# Altium project rev02.PrjPcb (part 2 of 2)

## Sheet rev02_18.SchDoc
size 282 x 200 mm
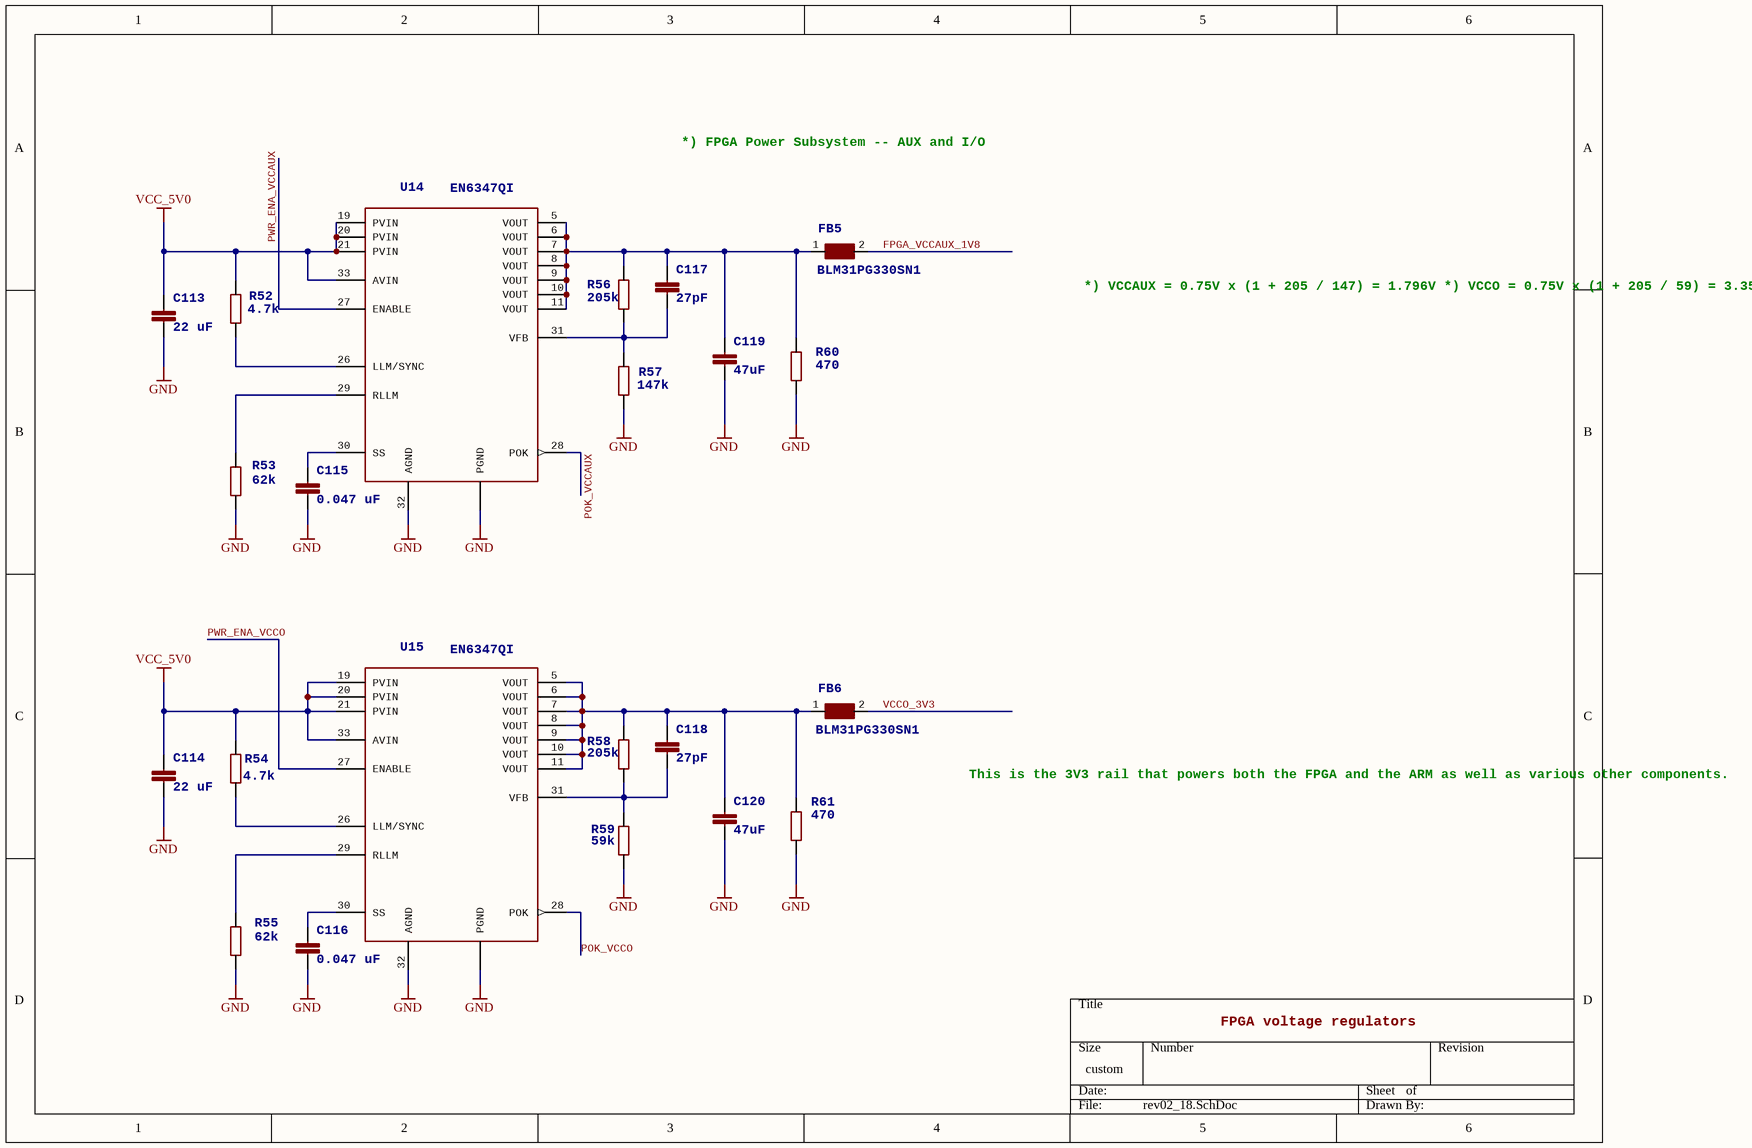
[diagram p20: rev02_18.SchDoc]

### Parts
C113  value 22 uF  >NAME: C113  [C_1210]  (hidden comment: C3225X5R1C226M250AA)
C114  value 22 uF  >NAME: C114  [C_1210]  (hidden comment: C3225X5R1C226M250AA)
C115  value 0.047 uF  >NAME: C115  [C_0402]
C116  value 0.047 uF  >NAME: C116  [C_0402]
C117  value 27pF  >NAME: C117  [C_0402]
C118  value 27pF  >NAME: C118  [C_0402]
C119  value 47uF  >NAME: C119  [C_1210]  (hidden comment: GRM32ER70J476ME20L)
C120  value 47uF  >NAME: C120  [C_1210]  (hidden comment: GRM32ER70J476ME20L)
FB5  BLM31PG330SN1  [L_1206]
FB6  BLM31PG330SN1  [L_1206]
R52  value 4.7k  >NAME: R52  [R_0402]
R53  value 62k  >NAME: R53  [R_0402]
R54  value 4.7k  >NAME: R54  [R_0402]
R55  value 62k  >NAME: R55  [R_0402]
R56  value 205k  >NAME: R56  [R_0402]
R57  value 147k  >NAME: R57  [R_0402]
R58  value 205k  >NAME: R58  [R_0402]
R59  value 59k  >NAME: R59  [R_0402]
R60  value 470  >NAME: R60  [R_0402]
R61  value 470  >NAME: R61  [R_0402]
U14  EN6347QI  [QFN38]
U15  EN6347QI  [QFN38]

### Nets
FPGA_VCCAUX_1V8: FB5.2
GND: C113.2 C114.2 C115.2 C116.2 C119.2 C120.2 R53.1 R55.1 R57.1 R59.1 R60.1 R61.1 U14.13(PGND) U14.14(PGND) U14.15(PGND) U14.16(PGND) U14.17(PGND) U14.18(PGND) U14.32(AGND) U14.PAD39(PGND) U15.13(PGND) U15.14(PGND) U15.15(PGND) U15.16(PGND) U15.17(PGND) U15.18(PGND) U15.32(AGND) U15.PAD39(PGND)
VCC_5V0: C113.1 C114.1 R52.2 R54.2 U14.19(PVIN) U14.20(PVIN) U14.21(PVIN) U14.33(AVIN) U15.19(PVIN) U15.20(PVIN) U15.21(PVIN) U15.33(AVIN)
VCCO_3V3: FB6.2
POK_VCCAUX: U14.28(POK)
POK_VCCO: U15.28(POK)
PWR_ENA_VCCAUX: U14.27(ENABLE)
PWR_ENA_VCCO: U15.27(ENABLE)
NetC115_1: C115.1 U14.30(SS)
NetC116_1: C116.1 U15.30(SS)
NetC117_1: C117.1 C119.1 FB5.1 R56.2 R60.2 U14.5(VOUT) U14.6(VOUT) U14.7(VOUT) U14.8(VOUT) U14.9(VOUT) U14.10(VOUT) U14.11(VOUT)
NetC117_2: C117.2 R56.1 R57.2 U14.31(VFB)
NetC118_1: C118.1 C120.1 FB6.1 R58.2 R61.2 U15.5(VOUT) U15.6(VOUT) U15.7(VOUT) U15.8(VOUT) U15.9(VOUT) U15.10(VOUT) U15.11(VOUT)
NetC118_2: C118.2 R58.1 R59.2 U15.31(VFB)
NetR52_1: R52.1 U14.26(LLM/SYNC)
NetR53_2: R53.2 U14.29(RLLM)
NetR54_1: R54.1 U15.26(LLM/SYNC)
NetR55_2: R55.2 U15.29(RLLM)

Not connected (* = marked no-connect by the designer): U14 1(NC) 2(NC) 3(NC) 4(NC) 12(NC) 22(NC) 23(NC) 24(NC) 25(NC) 34(NC) 35(NC) 36(NC) 37(NC) 38(NC); U15 1(NC) 2(NC) 3(NC) 4(NC) 12(NC) 22(NC) 23(NC) 24(NC) 25(NC) 34(NC) 35(NC) 36(NC) 37(NC) 38(NC)

### Notes on the sheet
- *) FPGA Power Subsystem -- AUX and I/O
- *) VCCAUX = 0.75V x (1 + 205 / 147) = 1.796V
  *) VCCO = 0.75V x (1 + 205 / 59) = 3.356
  *) Minimal load current is 2 mA:
  1.8V / 470 Ohm = ~4mA
  3.3V /  470 Ohm = ~7mA
  *) Light-load mode is enabled
- This is the 3V3 rail that powers
  both the FPGA and the ARM as well
  as various other components.
- FPGA voltage regulators

### Library data of the parts
C113 C114 = C-EUC1210: 1210 CAPACITOR; DIELECTRIC: X5R; RATED_VOLTAGE: 16V; TOLERANCE: 20%
C115 C116 = C-EUC0402: as C4 on sheet rev02_1
C117 C118 = C-EUC0402: 0402 CAPACITOR; DIELECTRIC: C0G; RATED_VOLTAGE: 50V; TOLERANCE: 5%
C119 C120 = C-EUC1210: as C8 on sheet rev02_1; DIELECTRIC: X5R
FB5 FB6 = BLM31PG330SN1_1206
R52-R55 R60 R61 = R-EU_R0402: 0402 Resistor 5%; TOLERANCE: 5%
R56-R59 = R-EU_R0402: 0402 Resistor 1%; TOLERANCE: 1%
U14 U15 = EN6347QI: 3A PowerSoC / Voltage Mode Synchronous PWM Buck with Integrated Inductor; >NAME: U14; MPN: EN6347QI; OC_FARNELL: 2081146; PACKAGE: QFN; SUPPLIER: ENPIRION; >VALUE: EN6347QI

## Sheet rev02_19.SchDoc
size 282 x 200 mm
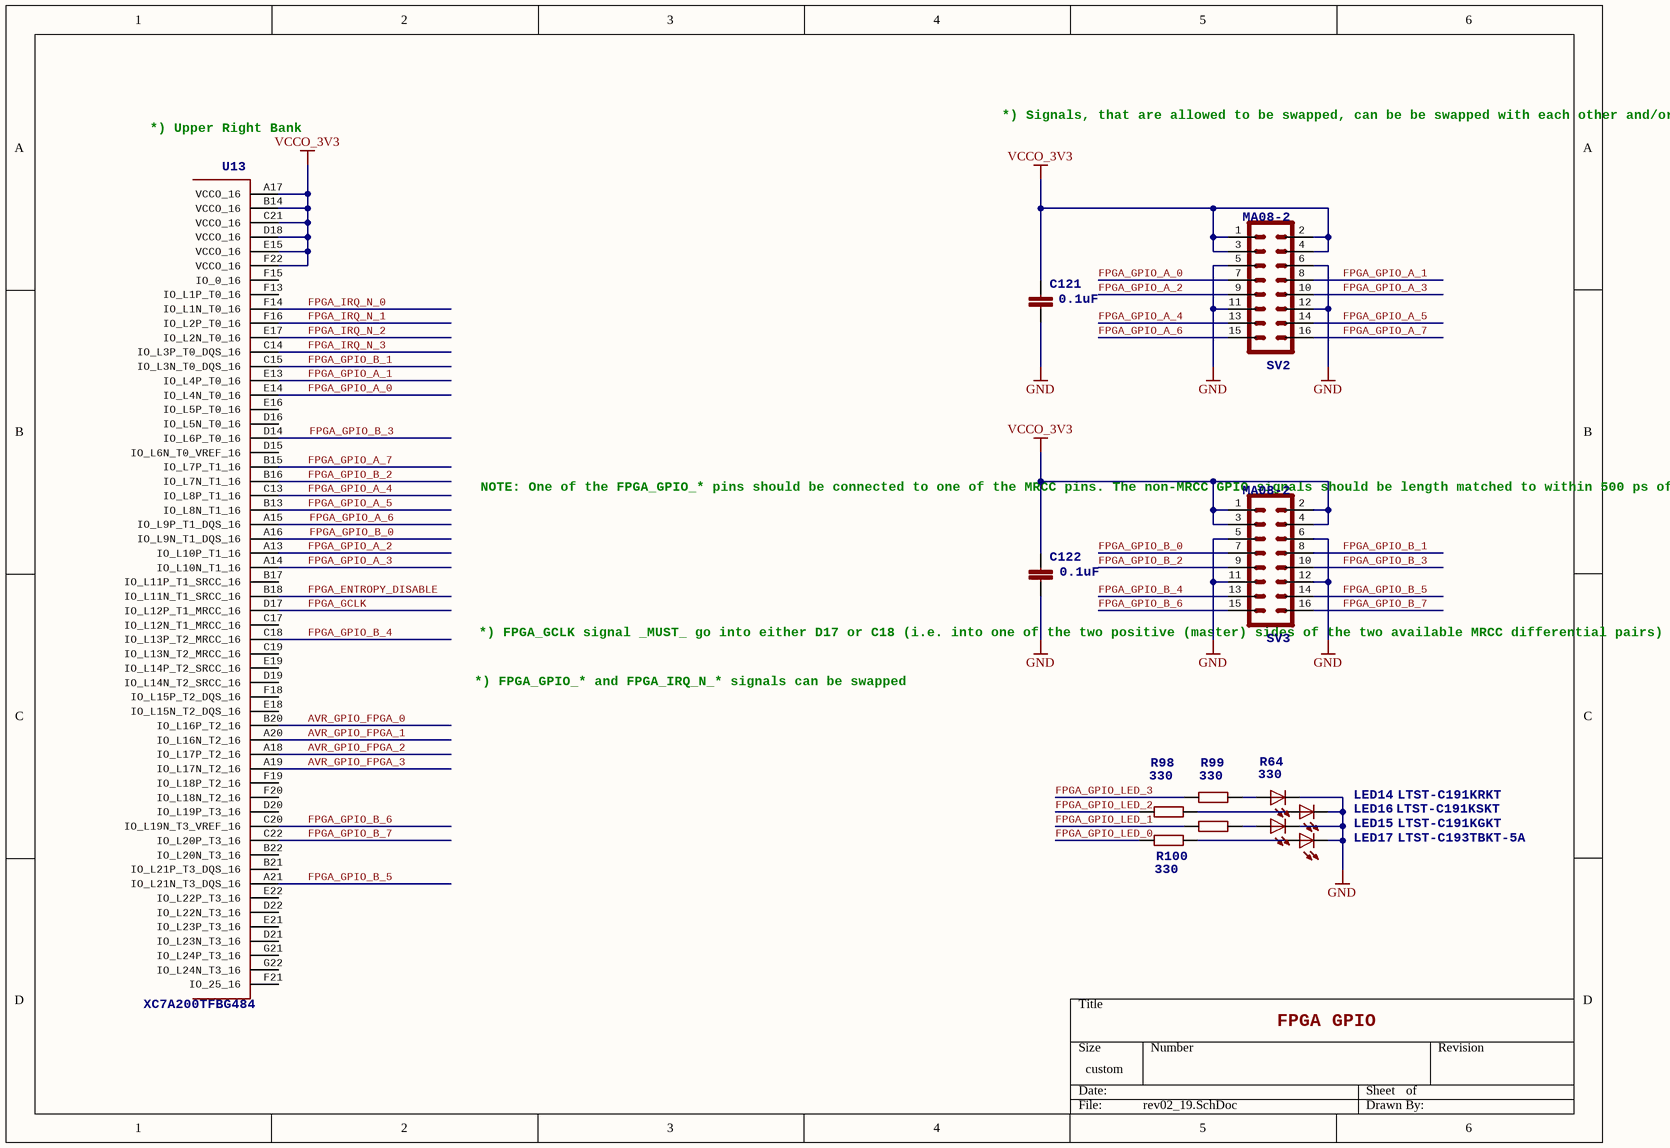
[diagram p21: rev02_19.SchDoc]

### Parts
C121  value 0.1uF  >NAME: C121  [C_0402]
C122  value 0.1uF  >NAME: C122  [C_0402]
LED14  LTST-C191KRKT  [VD_0603]
LED15  LTST-C191KGKT  [VD_0603]
LED16  LTST-C191KSKT  [VD_0603]
LED17  LTST-C193TBKT-5A  [VD_0603]
R64  value 330  [R_0402]
R98  value 330  [R_0402]
R99  value 330  [R_0402]
R100  value 330  [R_0402]
SV2  >NAME: SV2  [PLD-16]  (hidden comment: MA08-2)
SV3  >NAME: SV3  [PLD-16]  (hidden comment: MA08-2)
U13  >NAME: U13  [BGA484C100P22X22_2300X2300X254]  (hidden comment: XC7A200TFBG484)  (part E of 17)

### Nets
GND: C121.2 C122.2 LED14.2(C) LED15.2(C) LED16.2(C) LED17.2(C) SV2.5 SV2.6 SV2.11 SV2.12 SV3.5 SV3.6 SV3.11 SV3.12
VCCO_3V3: C121.1 C122.1 SV2.1 SV2.2 SV2.3 SV2.4 SV3.1 SV3.2 SV3.3 SV3.4 U13.A17(VCCO_16) U13.B14(VCCO_16) U13.C21(VCCO_16) U13.D18(VCCO_16) U13.E15(VCCO_16) U13.F22(VCCO_16)
AVR_GPIO_FPGA_0: U13.B20(IO_L16P_T2_16)
AVR_GPIO_FPGA_1: U13.A20(IO_L16N_T2_16)
AVR_GPIO_FPGA_2: U13.A18(IO_L17P_T2_16)
AVR_GPIO_FPGA_3: U13.A19(IO_L17N_T2_16)
FPGA_ENTROPY_DISABLE: U13.B18(IO_L11N_T1_SRCC_16)
FPGA_GCLK: U13.D17(IO_L12P_T1_MRCC_16)
FPGA_GPIO_A_0: SV2.7 U13.E14(IO_L4N_T0_16)
FPGA_GPIO_A_1: SV2.8 U13.E13(IO_L4P_T0_16)
FPGA_GPIO_A_2: SV2.9 U13.A13(IO_L10P_T1_16)
FPGA_GPIO_A_3: SV2.10 U13.A14(IO_L10N_T1_16)
FPGA_GPIO_A_4: SV2.13 U13.C13(IO_L8P_T1_16)
FPGA_GPIO_A_5: SV2.14 U13.B13(IO_L8N_T1_16)
FPGA_GPIO_A_6: SV2.15 U13.A15(IO_L9P_T1_DQS_16)
FPGA_GPIO_A_7: SV2.16 U13.B15(IO_L7P_T1_16)
FPGA_GPIO_B_0: SV3.7 U13.A16(IO_L9N_T1_DQS_16)
FPGA_GPIO_B_1: SV3.8 U13.C15(IO_L3N_T0_DQS_16)
FPGA_GPIO_B_2: SV3.9 U13.B16(IO_L7N_T1_16)
FPGA_GPIO_B_3: SV3.10 U13.D14(IO_L6P_T0_16)
FPGA_GPIO_B_4: SV3.13 U13.C18(IO_L13P_T2_MRCC_16)
FPGA_GPIO_B_5: SV3.14 U13.A21(IO_L21N_T3_DQS_16)
FPGA_GPIO_B_6: SV3.15 U13.C20(IO_L19N_T3_VREF_16)
FPGA_GPIO_B_7: SV3.16 U13.C22(IO_L20P_T3_16)
FPGA_GPIO_LED_0: R100.2
FPGA_GPIO_LED_1: R64.2
FPGA_GPIO_LED_2: R98.2
FPGA_GPIO_LED_3: R99.2
FPGA_IRQ_N_0: U13.F14(IO_L1N_T0_16)
FPGA_IRQ_N_1: U13.F16(IO_L2P_T0_16)
FPGA_IRQ_N_2: U13.E17(IO_L2N_T0_16)
FPGA_IRQ_N_3: U13.C14(IO_L3P_T0_DQS_16)
NetLED14_1: LED14.1(A) R99.1
NetLED15_1: LED15.1(A) R64.1
NetLED16_1: LED16.1(A) R98.1
NetLED17_1: LED17.1(A) R100.1

Not connected (* = marked no-connect by the designer): U13 B17(IO_L11P_T1_SRCC_16) B21(IO_L21P_T3_DQS_16) B22(IO_L20N_T3_16) C17(IO_L12N_T1_MRCC_16) C19(IO_L13N_T2_MRCC_16) D15(IO_L6N_T0_VREF_16) D16(IO_L5N_T0_16) D19(IO_L14N_T2_SRCC_16) D20(IO_L19P_T3_16) D21(IO_L23N_T3_16) D22(IO_L22N_T3_16) E16(IO_L5P_T0_16) E18(IO_L15N_T2_DQS_16) E19(IO_L14P_T2_SRCC_16) E21(IO_L23P_T3_16) E22(IO_L22P_T3_16) F13(IO_L1P_T0_16) F15(IO_0_16) F18(IO_L15P_T2_DQS_16) F19(IO_L18P_T2_16) F20(IO_L18N_T2_16) F21(IO_25_16) G21(IO_L24P_T3_16) G22(IO_L24N_T3_16)

### Notes on the sheet
- *) Upper Right Bank
- *) Signals, that are allowed to be swapped, can be be swapped
  with each other and/or moved to different pins within their bank.
- (near SV3) NOTE: One of the FPGA_GPIO_* pins
  should be connected to one of the
  MRCC pins.
  The non-MRCC GPIO signals should be
  length matched to within 500 ps of
  the MRCC signal.
- (near SV3) *) FPGA_GCLK signal _MUST_ go into either D17 or C18
  (i.e. into one of the two positive (master) sides
  of the two available MRCC differential pairs)
- *) FPGA_GPIO_* and FPGA_IRQ_N_* signals can be swapped
- FPGA GPIO

### Library data of the parts
C121 C122 = C-EUC0402: 0402 CAPACITOR; DIELECTRIC: X7R; RATED_VOLTAGE: 50V; TOLERANCE: 10%; >VALUE: 0.1 uF
LED14 = LEDCHIP-LED0603: RED LED
LED15 = LEDCHIP-LED0603: GREEN LED
LED16 = LEDCHIP-LED0603: YELLOW LED
LED17 = LEDCHIP-LED0603: BLUE LED
R64 R98-R100 = R-EU_R0402: 0402 Resistor 5%
SV2 SV3 = MA08-2: PIN HEADER 0.1"; OC_FARNELL: unknown; OC_NEWARK: unknown; >VALUE: MA08-2
U13 = XC7A200TFBG484: Xilinx FPGA: XC7A200TFBG484; MPN: XC7A200T-1FBG484C; MFR: Xilinx; OC_DIGIKEY: 122-1871-ND; >VALUE: XC7A200TFBG484

## Sheet rev02_20.SchDoc
size 282 x 200 mm
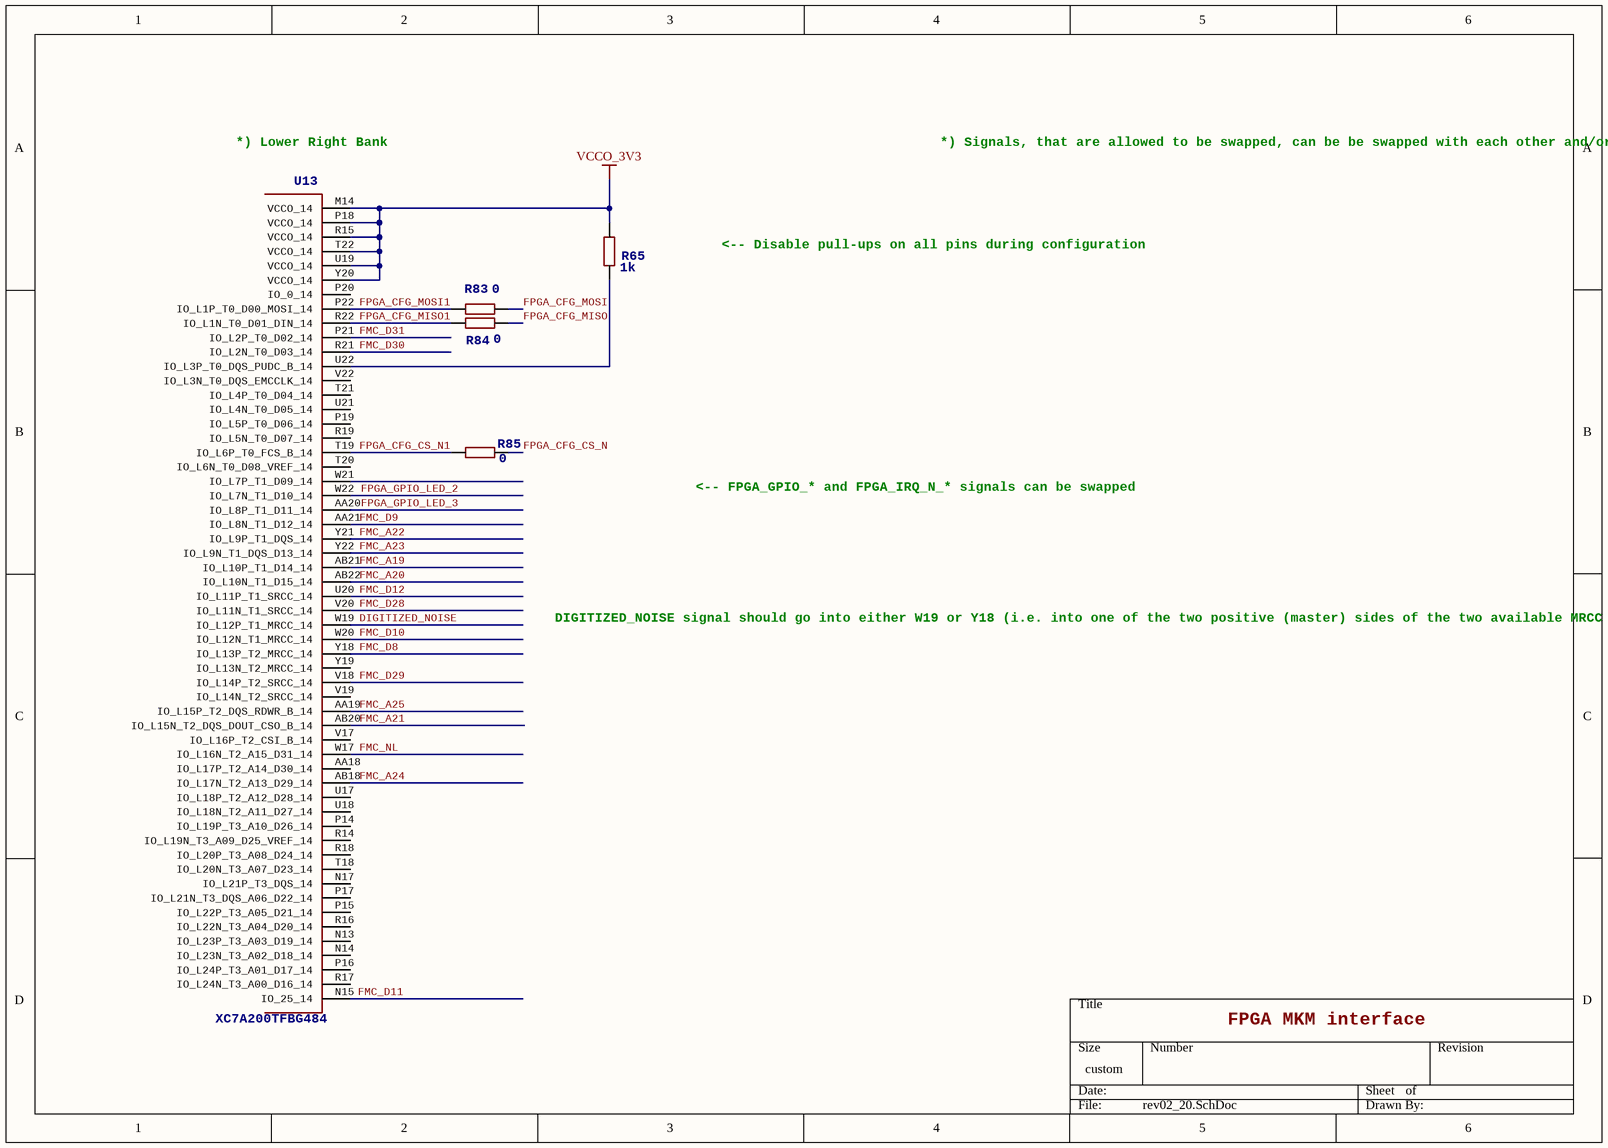
[diagram p22: rev02_20.SchDoc]

### Parts
R65  value 1k  >NAME: R65  [R_0402]
R83  value 0  [R_0402]
R84  value 0  [R_0402]
R85  value 0  [R_0402]
U13  >NAME: U13  [BGA484C100P22X22_2300X2300X254]  (hidden comment: XC7A200TFBG484)  (part C of 17)

### Nets
VCCO_3V3: R65.2 U13.M14(VCCO_14) U13.P18(VCCO_14) U13.R15(VCCO_14) U13.T22(VCCO_14) U13.U19(VCCO_14) U13.Y20(VCCO_14)
DIGITIZED_NOISE: U13.W19(IO_L12P_T1_MRCC_14)
FMC_A19: U13.AB21(IO_L10P_T1_D14_14)
FMC_A20: U13.AB22(IO_L10N_T1_D15_14)
FMC_A21: U13.AB20(IO_L15N_T2_DQS_DOUT_CSO_B_14)
FMC_A22: U13.Y21(IO_L9P_T1_DQS_14)
FMC_A23: U13.Y22(IO_L9N_T1_DQS_D13_14)
FMC_A24: U13.AB18(IO_L17N_T2_A13_D29_14)
FMC_A25: U13.AA19(IO_L15P_T2_DQS_RDWR_B_14)
FMC_D8: U13.Y18(IO_L13P_T2_MRCC_14)
FMC_D9: U13.AA21(IO_L8N_T1_D12_14)
FMC_D10: U13.W20(IO_L12N_T1_MRCC_14)
FMC_D11: U13.N15(IO_25_14)
FMC_D12: U13.U20(IO_L11P_T1_SRCC_14)
FMC_D28: U13.V20(IO_L11N_T1_SRCC_14)
FMC_D29: U13.V18(IO_L14P_T2_SRCC_14)
FMC_D30: U13.R21(IO_L2N_T0_D03_14)
FMC_D31: U13.P21(IO_L2P_T0_D02_14)
FMC_NL: U13.W17(IO_L16N_T2_A15_D31_14)
FPGA_CFG_CS_N: R85.1
FPGA_CFG_CS_N1: R85.2 U13.T19(IO_L6P_T0_FCS_B_14)
FPGA_CFG_MISO: R84.1
FPGA_CFG_MISO1: R84.2 U13.R22(IO_L1N_T0_D01_DIN_14)
FPGA_CFG_MOSI: R83.1
FPGA_CFG_MOSI1: R83.2 U13.P22(IO_L1P_T0_D00_MOSI_14)
FPGA_GPIO_LED_2: U13.W22(IO_L7N_T1_D10_14)
FPGA_GPIO_LED_3: U13.AA20(IO_L8P_T1_D11_14)
NetR65_1: R65.1 U13.U22(IO_L3P_T0_DQS_PUDC_B_14)

Not connected (* = marked no-connect by the designer): U13 AA18(IO_L17P_T2_A14_D30_14) N13(IO_L23P_T3_A03_D19_14) N14(IO_L23N_T3_A02_D18_14) N17(IO_L21P_T3_DQS_14) P14(IO_L19P_T3_A10_D26_14) P15(IO_L22P_T3_A05_D21_14) P16(IO_L24P_T3_A01_D17_14) P17(IO_L21N_T3_DQS_A06_D22_14) P19(IO_L5P_T0_D06_14) P20(IO_0_14) R14(IO_L19N_T3_A09_D25_VREF_14) R16(IO_L22N_T3_A04_D20_14) R17(IO_L24N_T3_A00_D16_14) R18(IO_L20P_T3_A08_D24_14) R19(IO_L5N_T0_D07_14) T18(IO_L20N_T3_A07_D23_14) T20(IO_L6N_T0_D08_VREF_14) T21(IO_L4P_T0_D04_14) U17(IO_L18P_T2_A12_D28_14) U18(IO_L18N_T2_A11_D27_14) U21(IO_L4N_T0_D05_14) V17(IO_L16P_T2_CSI_B_14) V19(IO_L14N_T2_SRCC_14) V22(IO_L3N_T0_DQS_EMCCLK_14) W21(IO_L7P_T1_D09_14) Y19(IO_L13N_T2_MRCC_14)

### Notes on the sheet
- *) Lower Right Bank
- *) Signals, that are allowed to be swapped, can be be swapped
  with each other and/or moved to different pins within their bank.
- <-- Disable pull-ups on all pins during configuration
- <-- FPGA_GPIO_* and FPGA_IRQ_N_* signals can be swapped
- DIGITIZED_NOISE signal should go into
  either W19 or Y18 (i.e. into one of the two
  positive (master) sides of the two available
  MRCC differential pairs)
- FPGA MKM interface

### Library data of the parts
R65 = R-EU_R0402: 0402 Resistor 5%; TOLERANCE: 5%
R83-R85 = R-EU_R0603: 0402 Resistor 5%
U13 = XC7A200TFBG484: as U13 on sheet rev02_19; MFR: Xilinx; OC_DIGIKEY: 122-1871-ND; >VALUE: XC7A200TFBG484

## Sheet rev02_21.SchDoc
size 282 x 200 mm
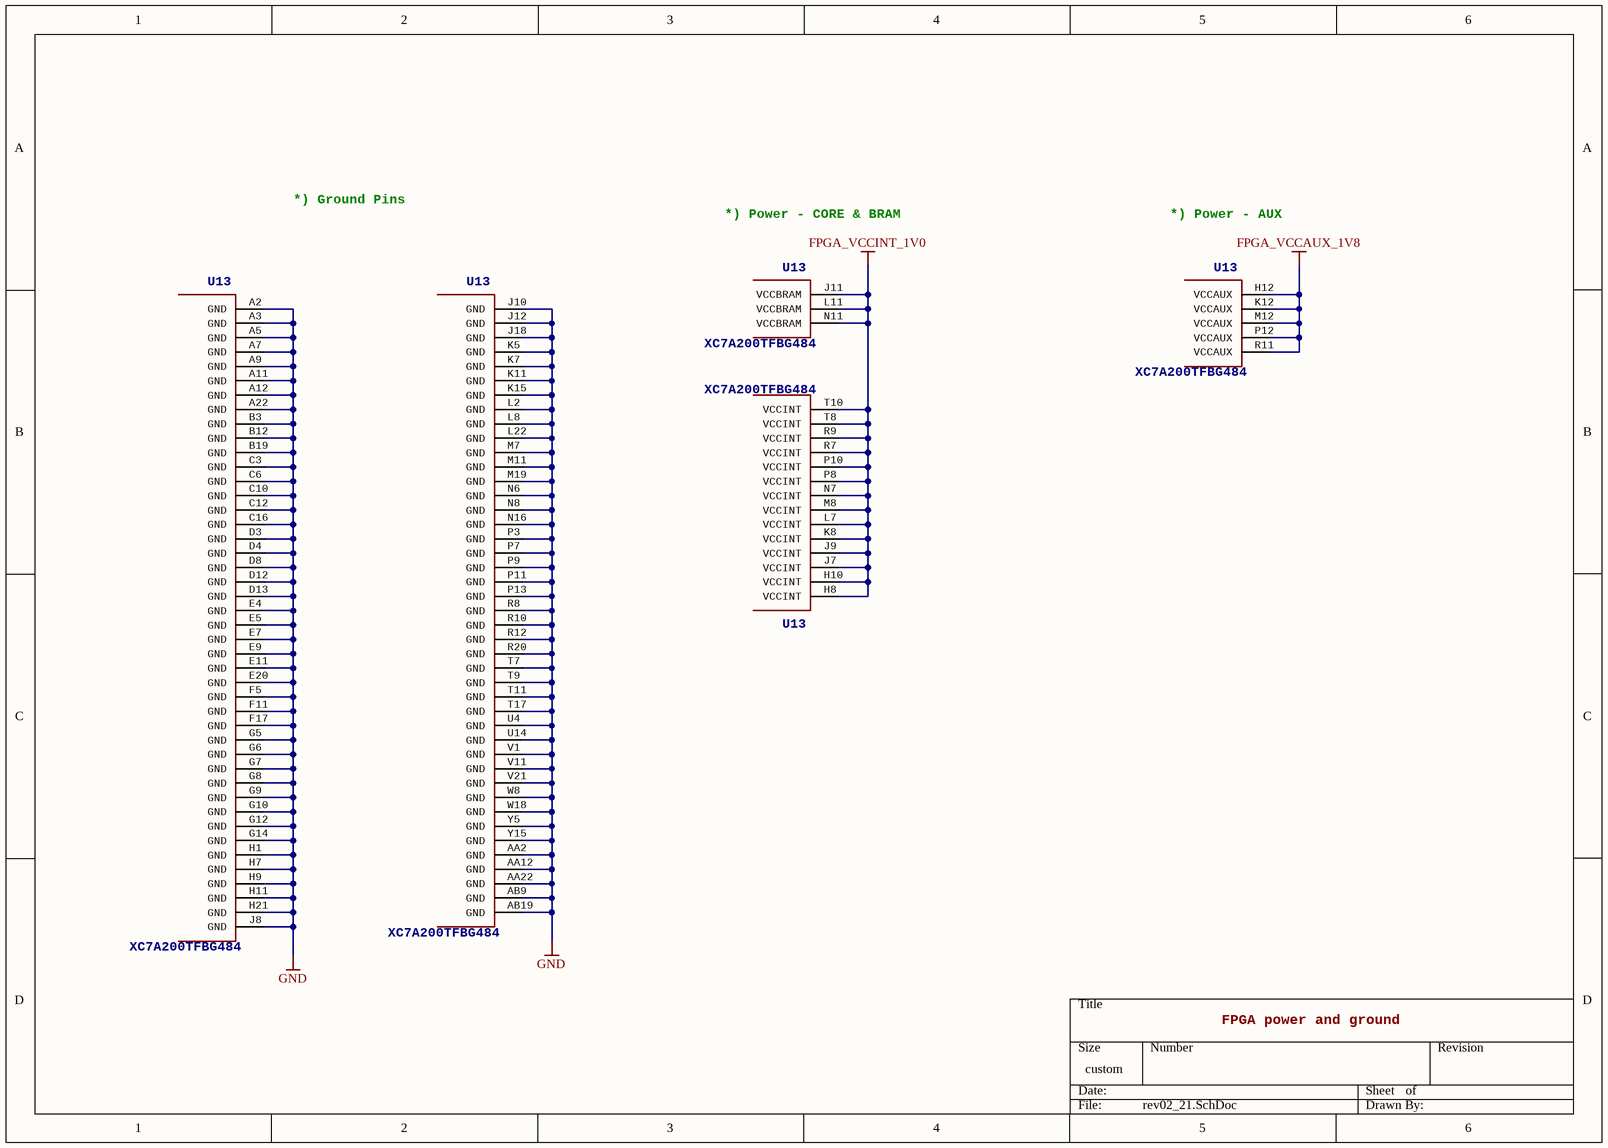
[diagram p23: rev02_21.SchDoc]

### Parts
U13  >NAME: U13  [BGA484C100P22X22_2300X2300X254]  (hidden comment: XC7A200TFBG484)  (parts I,J,N,O,P of 17)

### Nets
FPGA_VCCAUX_1V8: U13.H12(VCCAUX) U13.K12(VCCAUX) U13.M12(VCCAUX) U13.P12(VCCAUX) U13.R11(VCCAUX)
FPGA_VCCINT_1V0: U13.H8(VCCINT) U13.H10(VCCINT) U13.J7(VCCINT) U13.J9(VCCINT) U13.J11(VCCBRAM) U13.K8(VCCINT) U13.L7(VCCINT) U13.L11(VCCBRAM) U13.M8(VCCINT) U13.N7(VCCINT) U13.N11(VCCBRAM) U13.P8(VCCINT) U13.P10(VCCINT) U13.R7(VCCINT) U13.R9(VCCINT) U13.T8(VCCINT) U13.T10(VCCINT)
GND: U13.A2(GND) U13.A3(GND) U13.A5(GND) U13.A7(GND) U13.A9(GND) U13.A11(GND) U13.A12(GND) U13.A22(GND) U13.AA2(GND) U13.AA12(GND) U13.AA22(GND) U13.AB9(GND) U13.AB19(GND) U13.B3(GND) U13.B12(GND) U13.B19(GND) U13.C3(GND) U13.C6(GND) U13.C10(GND) U13.C12(GND) U13.C16(GND) U13.D3(GND) U13.D4(GND) U13.D8(GND) U13.D12(GND) U13.D13(GND) U13.E4(GND) U13.E5(GND) U13.E7(GND) U13.E9(GND) U13.E11(GND) U13.E20(GND) U13.F5(GND) U13.F11(GND) U13.F17(GND) U13.G5(GND) U13.G6(GND) U13.G7(GND) U13.G8(GND) U13.G9(GND) U13.G10(GND) U13.G12(GND) U13.G14(GND) U13.H1(GND) U13.H7(GND) U13.H9(GND) U13.H11(GND) U13.H21(GND) U13.J8(GND) U13.J10(GND) U13.J12(GND) U13.J18(GND) U13.K5(GND) U13.K7(GND) U13.K11(GND) U13.K15(GND) U13.L2(GND) U13.L8(GND) U13.L22(GND) U13.M7(GND) U13.M11(GND) U13.M19(GND) U13.N6(GND) U13.N8(GND) U13.N16(GND) U13.P3(GND) U13.P7(GND) U13.P9(GND) U13.P11(GND) U13.P13(GND) U13.R8(GND) U13.R10(GND) U13.R12(GND) U13.R20(GND) U13.T7(GND) U13.T9(GND) U13.T11(GND) U13.T17(GND) U13.U4(GND) U13.U14(GND) U13.V1(GND) U13.V11(GND) U13.V21(GND) U13.W8(GND) U13.W18(GND) U13.Y5(GND) U13.Y15(GND)

### Notes on the sheet
- *) Ground Pins
- *) Power - CORE & BRAM
- *) Power - AUX
- FPGA power and ground

### Library data of the parts
U13 = XC7A200TFBG484: as U13 on sheet rev02_19; MFR: Xilinx; OC_DIGIKEY: 122-1871-ND; >VALUE: XC7A200TFBG484

## Sheet rev02_22.SchDoc
size 282 x 200 mm
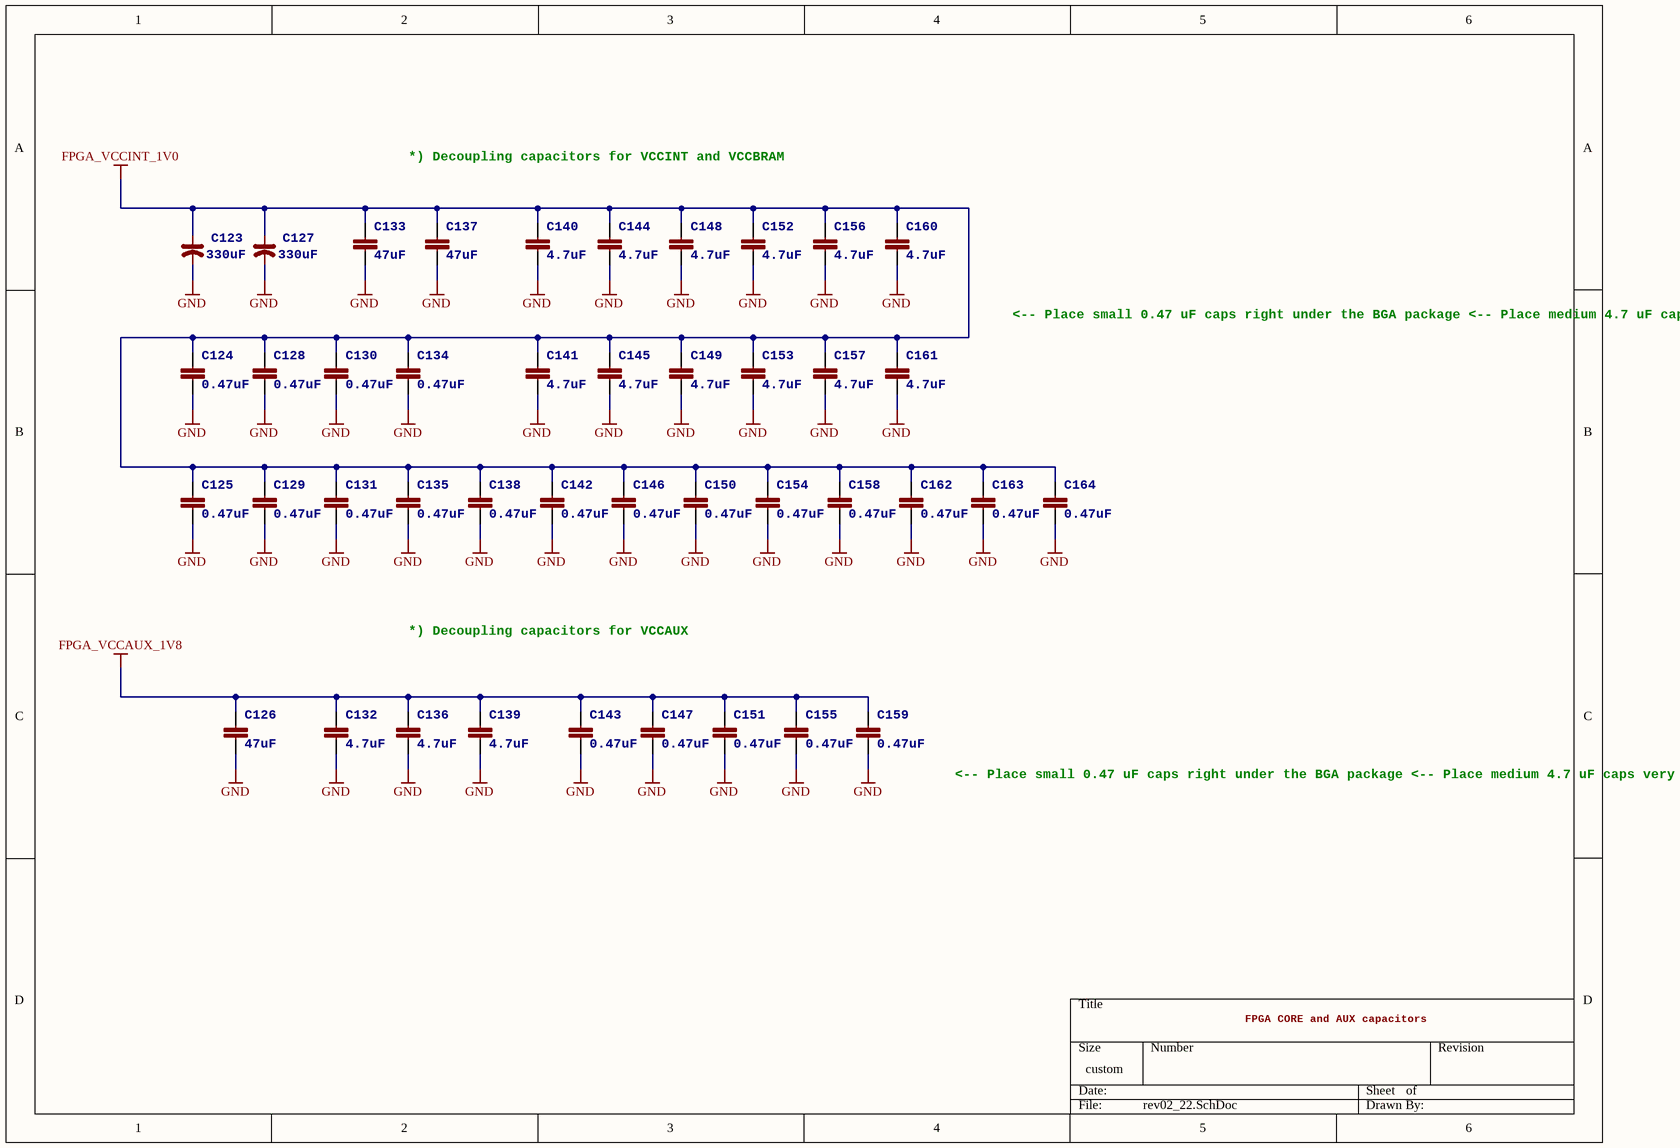
[diagram p24: rev02_22.SchDoc]

### Parts
C123  value 330uF  [C_D]  (hidden comment: T520D337M006ATE015)
C124  value 0.47uF  >NAME: C124  [C_0402]  (hidden comment: GRM155R61A474KE15D)
C125  value 0.47uF  >NAME: C125  [C_0402]  (hidden comment: GRM155R61A474KE15D)
C126  value 47uF  >NAME: C126  [C_1210]  (hidden comment: GRM32ER70J476ME20L)
C127  value 330uF  [C_D]  (hidden comment: T520D337M006ATE015)
C128  value 0.47uF  >NAME: C128  [C_0402]  (hidden comment: GRM155R61A474KE15D)
C129  value 0.47uF  >NAME: C129  [C_0402]  (hidden comment: GRM155R61A474KE15D)
C130  value 0.47uF  >NAME: C130  [C_0402]  (hidden comment: GRM155R61A474KE15D)
C131  value 0.47uF  >NAME: C131  [C_0402]  (hidden comment: GRM155R61A474KE15D)
C132  value 4.7uF  >NAME: C132  [C_0805]  (hidden comment: GRM21BR71A475KA73L)
C133  value 47uF  >NAME: C133  [C_1210]  (hidden comment: GRM32ER70J476ME20L)
C134  value 0.47uF  >NAME: C134  [C_0402]  (hidden comment: GRM155R61A474KE15D)
C135  value 0.47uF  >NAME: C135  [C_0402]  (hidden comment: GRM155R61A474KE15D)
C136  value 4.7uF  >NAME: C136  [C_0805]  (hidden comment: GRM21BR71A475KA73L)
C137  value 47uF  >NAME: C137  [C_1210]  (hidden comment: GRM32ER70J476ME20L)
C138  value 0.47uF  >NAME: C138  [C_0402]  (hidden comment: GRM155R61A474KE15D)
C139  value 4.7uF  >NAME: C139  [C_0805]  (hidden comment: GRM21BR71A475KA73L)
C140  value 4.7uF  >NAME: C140  [C_0805]  (hidden comment: GRM21BR71A475KA73L)
C141  value 4.7uF  >NAME: C141  [C_0805]  (hidden comment: GRM21BR71A475KA73L)
C142  value 0.47uF  >NAME: C142  [C_0402]  (hidden comment: GRM155R61A474KE15D)
C143  value 0.47uF  >NAME: C143  [C_0402]  (hidden comment: GRM155R61A474KE15D)
C144  value 4.7uF  >NAME: C144  [C_0805]  (hidden comment: GRM21BR71A475KA73L)
C145  value 4.7uF  >NAME: C145  [C_0805]  (hidden comment: GRM21BR71A475KA73L)
C146  value 0.47uF  >NAME: C146  [C_0402]  (hidden comment: GRM155R61A474KE15D)
C147  value 0.47uF  >NAME: C147  [C_0402]  (hidden comment: GRM155R61A474KE15D)
C148  value 4.7uF  >NAME: C148  [C_0805]  (hidden comment: GRM21BR71A475KA73L)
C149  value 4.7uF  >NAME: C149  [C_0805]  (hidden comment: GRM21BR71A475KA73L)
C150  value 0.47uF  >NAME: C150  [C_0402]  (hidden comment: GRM155R61A474KE15D)
C151  value 0.47uF  >NAME: C151  [C_0402]  (hidden comment: GRM155R61A474KE15D)
C152  value 4.7uF  >NAME: C152  [C_0805]  (hidden comment: GRM21BR71A475KA73L)
C153  value 4.7uF  >NAME: C153  [C_0805]  (hidden comment: GRM21BR71A475KA73L)
C154  value 0.47uF  >NAME: C154  [C_0402]  (hidden comment: GRM155R61A474KE15D)
C155  value 0.47uF  >NAME: C155  [C_0402]  (hidden comment: GRM155R61A474KE15D)
C156  value 4.7uF  >NAME: C156  [C_0805]  (hidden comment: GRM21BR71A475KA73L)
C157  value 4.7uF  >NAME: C157  [C_0805]  (hidden comment: GRM21BR71A475KA73L)
C158  value 0.47uF  >NAME: C158  [C_0402]  (hidden comment: GRM155R61A474KE15D)
C159  value 0.47uF  >NAME: C159  [C_0402]  (hidden comment: GRM155R61A474KE15D)
C160  value 4.7uF  >NAME: C160  [C_0805]  (hidden comment: GRM21BR71A475KA73L)
C161  value 4.7uF  >NAME: C161  [C_0805]  (hidden comment: GRM21BR71A475KA73L)
C162  value 0.47uF  >NAME: C162  [C_0402]  (hidden comment: GRM155R61A474KE15D)
C163  value 0.47uF  >NAME: C163  [C_0402]  (hidden comment: GRM155R61A474KE15D)
C164  value 0.47uF  >NAME: C164  [C_0402]  (hidden comment: GRM155R61A474KE15D)

### Nets
FPGA_VCCAUX_1V8: C126.1 C132.1 C136.1 C139.1 C143.1 C147.1 C151.1 C155.1 C159.1
FPGA_VCCINT_1V0: C123.1(+) C124.1 C125.1 C127.1(+) C128.1 C129.1 C130.1 C131.1 C133.1 C134.1 C135.1 C137.1 C138.1 C140.1 C141.1 C142.1 C144.1 C145.1 C146.1 C148.1 C149.1 C150.1 C152.1 C153.1 C154.1 C156.1 C157.1 C158.1 C160.1 C161.1 C162.1 C163.1 C164.1
GND: C123.2(-) C124.2 C125.2 C126.2 C127.2(-) C128.2 C129.2 C130.2 C131.2 C132.2 C133.2 C134.2 C135.2 C136.2 C137.2 C138.2 C139.2 C140.2 C141.2 C142.2 C143.2 C144.2 C145.2 C146.2 C147.2 C148.2 C149.2 C150.2 C151.2 C152.2 C153.2 C154.2 C155.2 C156.2 C157.2 C158.2 C159.2 C160.2 C161.2 C162.2 C163.2 C164.2

### Notes on the sheet
- *) Decoupling capacitors for VCCINT and VCCBRAM
- <-- Place small 0.47 uF caps right under the BGA package
  <-- Place medium 4.7 uF caps very close to the BGA
  package
  <-- Place large 47 uF and 330 uF caps not far
  from the BGA package
  <-- Distribute smaller caps evenly under the BGA package
  <-- Distribute larger caps evenly around the BGA package
- *) Decoupling capacitors for VCCAUX
- <-- Place small 0.47 uF caps right under the BGA package
  <-- Place medium 4.7 uF caps very close to the BGA package
  <-- Place large 47 uF caps not far from the BGA package
  <-- Try to place smaller caps next to FPGA balls
- FPGA CORE and AUX capacitors

### Library data of the parts
C123 C127 = CP_E-035X080: Kemet Tantalum Capacitor
C124 C125 C128-C131 C134 C135 C138 C142 C143 C146 C147 C150 C151 C154 C155 C158 C159 C162-C164 = C-EUC0402: 0402 CAPACITOR; DIELECTRIC: X5R; RATED_VOLTAGE: 6.3V; TOLERANCE: 10%
C126 C133 C137 = C-EUC1210: 1210 CAPACITOR X5R 6.3V; RATED_VOLTAGE: 16V; TOLERANCE: 20%; DIELECTRIC: X5R
C132 C136 C139-C141 C144 C145 C148 C149 C152 C153 C156 C157 C160 C161 = C-EUC0603: 0805 CAPACITOR; DIELECTRIC: X5R; RATED_VOLTAGE: 16V; TOLERANCE: 10%

## Sheet rev02_23.SchDoc
size 282 x 200 mm
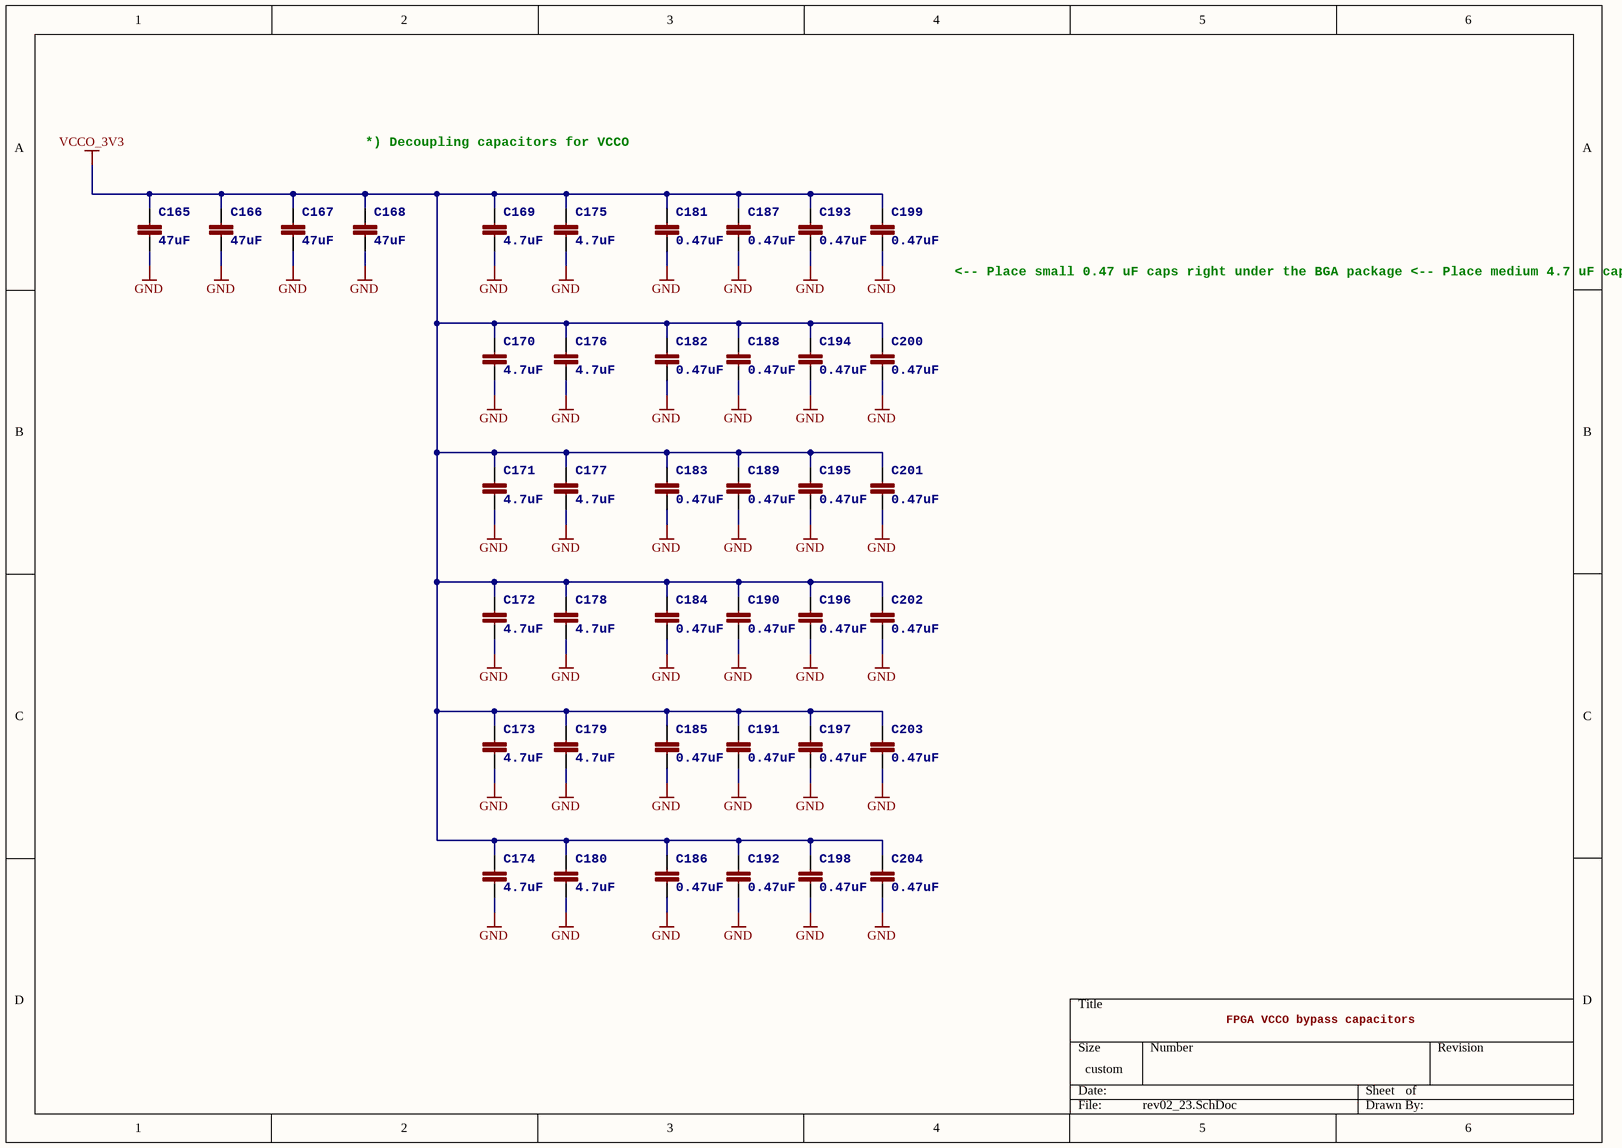
[diagram p25: rev02_23.SchDoc]

### Parts
C165  value 47uF  >NAME: C165  [C_1210]  (hidden comment: GRM32ER70J476ME20L)
C166  value 47uF  >NAME: C166  [C_1210]  (hidden comment: GRM32ER70J476ME20L)
C167  value 47uF  >NAME: C167  [C_1210]  (hidden comment: GRM32ER70J476ME20L)
C168  value 47uF  >NAME: C168  [C_1210]  (hidden comment: GRM32ER70J476ME20L)
C169  value 4.7uF  >NAME: C169  [C_0805]  (hidden comment: GRM21BR71A475KA73L)
C170  value 4.7uF  >NAME: C170  [C_0805]  (hidden comment: GRM21BR71A475KA73L)
C171  value 4.7uF  >NAME: C171  [C_0805]  (hidden comment: GRM21BR71A475KA73L)
C172  value 4.7uF  >NAME: C172  [C_0805]  (hidden comment: GRM21BR71A475KA73L)
C173  value 4.7uF  >NAME: C173  [C_0805]  (hidden comment: GRM21BR71A475KA73L)
C174  value 4.7uF  >NAME: C174  [C_0805]  (hidden comment: GRM21BR71A475KA73L)
C175  value 4.7uF  >NAME: C175  [C_0805]  (hidden comment: GRM21BR71A475KA73L)
C176  value 4.7uF  >NAME: C176  [C_0805]  (hidden comment: GRM21BR71A475KA73L)
C177  value 4.7uF  >NAME: C177  [C_0805]  (hidden comment: GRM21BR71A475KA73L)
C178  value 4.7uF  >NAME: C178  [C_0805]  (hidden comment: GRM21BR71A475KA73L)
C179  value 4.7uF  >NAME: C179  [C_0805]  (hidden comment: GRM21BR71A475KA73L)
C180  value 4.7uF  >NAME: C180  [C_0805]  (hidden comment: GRM21BR71A475KA73L)
C181  value 0.47uF  >NAME: C181  [C_0402]  (hidden comment: GRM155R61A474KE15D)
C182  value 0.47uF  >NAME: C182  [C_0402]  (hidden comment: GRM155R61A474KE15D)
C183  value 0.47uF  >NAME: C183  [C_0402]  (hidden comment: GRM155R61A474KE15D)
C184  value 0.47uF  >NAME: C184  [C_0402]  (hidden comment: GRM155R61A474KE15D)
C185  value 0.47uF  >NAME: C185  [C_0402]  (hidden comment: GRM155R61A474KE15D)
C186  value 0.47uF  >NAME: C186  [C_0402]  (hidden comment: GRM155R61A474KE15D)
C187  value 0.47uF  >NAME: C187  [C_0402]  (hidden comment: GRM155R61A474KE15D)
C188  value 0.47uF  >NAME: C188  [C_0402]  (hidden comment: GRM155R61A474KE15D)
C189  value 0.47uF  >NAME: C189  [C_0402]  (hidden comment: GRM155R61A474KE15D)
C190  value 0.47uF  >NAME: C190  [C_0402]  (hidden comment: GRM155R61A474KE15D)
C191  value 0.47uF  >NAME: C191  [C_0402]  (hidden comment: GRM155R61A474KE15D)
C192  value 0.47uF  >NAME: C192  [C_0402]  (hidden comment: GRM155R61A474KE15D)
C193  value 0.47uF  >NAME: C193  [C_0402]  (hidden comment: GRM155R61A474KE15D)
C194  value 0.47uF  >NAME: C194  [C_0402]  (hidden comment: GRM155R61A474KE15D)
C195  value 0.47uF  >NAME: C195  [C_0402]  (hidden comment: GRM155R61A474KE15D)
C196  value 0.47uF  >NAME: C196  [C_0402]  (hidden comment: GRM155R61A474KE15D)
C197  value 0.47uF  >NAME: C197  [C_0402]  (hidden comment: GRM155R61A474KE15D)
C198  value 0.47uF  >NAME: C198  [C_0402]  (hidden comment: GRM155R61A474KE15D)
C199  value 0.47uF  >NAME: C199  [C_0402]  (hidden comment: GRM155R61A474KE15D)
C200  value 0.47uF  >NAME: C200  [C_0402]  (hidden comment: GRM155R61A474KE15D)
C201  value 0.47uF  >NAME: C201  [C_0402]  (hidden comment: GRM155R61A474KE15D)
C202  value 0.47uF  >NAME: C202  [C_0402]  (hidden comment: GRM155R61A474KE15D)
C203  value 0.47uF  >NAME: C203  [C_0402]  (hidden comment: GRM155R61A474KE15D)
C204  value 0.47uF  >NAME: C204  [C_0402]  (hidden comment: GRM155R61A474KE15D)

### Nets
GND: C165.2 C166.2 C167.2 C168.2 C169.2 C170.2 C171.2 C172.2 C173.2 C174.2 C175.2 C176.2 C177.2 C178.2 C179.2 C180.2 C181.2 C182.2 C183.2 C184.2 C185.2 C186.2 C187.2 C188.2 C189.2 C190.2 C191.2 C192.2 C193.2 C194.2 C195.2 C196.2 C197.2 C198.2 C199.2 C200.2 C201.2 C202.2 C203.2 C204.2
VCCO_3V3: C165.1 C166.1 C167.1 C168.1 C169.1 C170.1 C171.1 C172.1 C173.1 C174.1 C175.1 C176.1 C177.1 C178.1 C179.1 C180.1 C181.1 C182.1 C183.1 C184.1 C185.1 C186.1 C187.1 C188.1 C189.1 C190.1 C191.1 C192.1 C193.1 C194.1 C195.1 C196.1 C197.1 C198.1 C199.1 C200.1 C201.1 C202.1 C203.1 C204.1

### Notes on the sheet
- *) Decoupling capacitors for VCCO
- <-- Place small 0.47 uF caps right under the BGA package
  <-- Place medium 4.7 uF caps very close to the BGA package
  <-- Place large 47 uF caps not far from the BGA package
  <-- Place one of four 47 uF caps on every side of the BGA p.
  <-- Distribute six sets of caps among six FPGA I/O banks
- FPGA VCCO bypass capacitors

### Library data of the parts
C165-C168 = C-EUC1210: as C126 on sheet rev02_22; DIELECTRIC: X5R
C169-C180 = C-EUC0603: as C132 on sheet rev02_22
C181-C204 = C-EUC0402: as C124 on sheet rev02_22

## Sheet rev02_24.SchDoc
size 282 x 200 mm
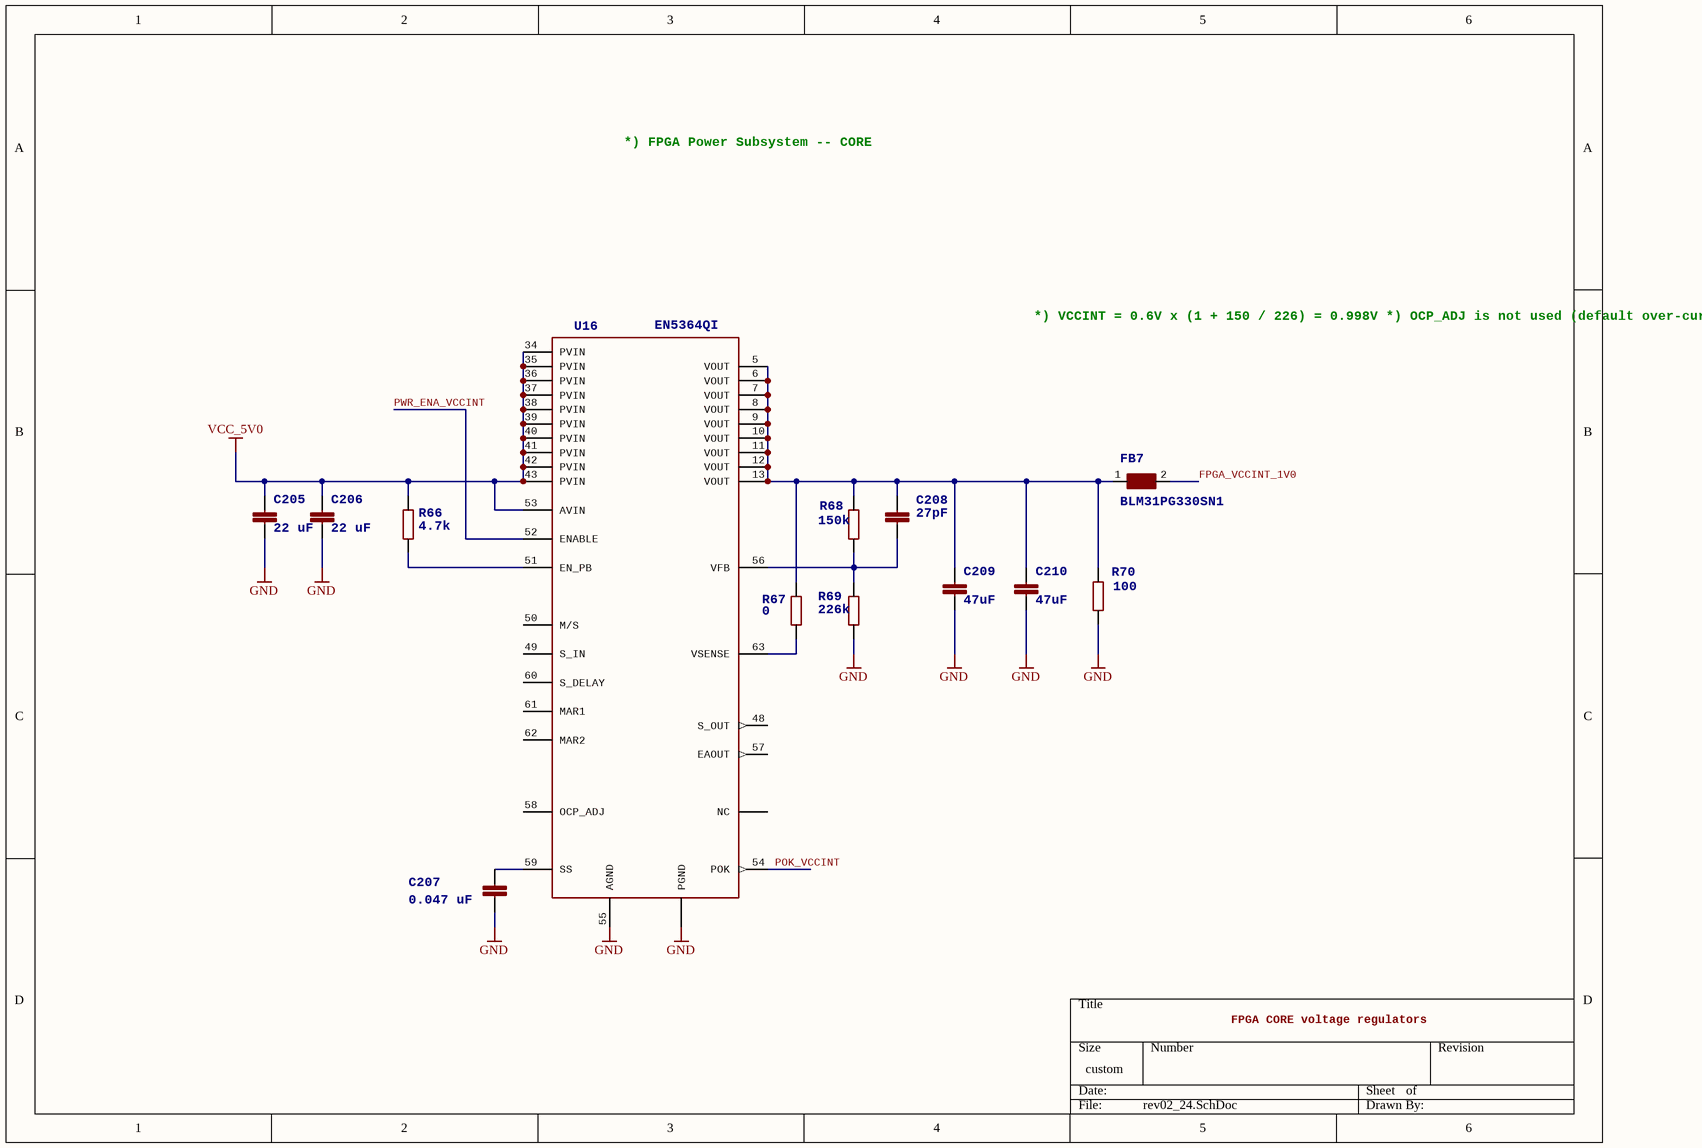
[diagram p26: rev02_24.SchDoc]

### Parts
C205  value 22 uF  >NAME: C205  [C_1210]  (hidden comment: C3225X5R1C226M250AA)
C206  value 22 uF  >NAME: C206  [C_1210]  (hidden comment: C3225X5R1C226M250AA)
C207  value 0.047 uF  [C_0402]
C208  value 27pF  >NAME: C208  [C_0402]
C209  value 47uF  >NAME: C209  [C_1210]  (hidden comment: GRM32ER70J476ME20L)
C210  value 47uF  >NAME: C210  [C_1210]  (hidden comment: GRM32ER70J476ME20L)
FB7  BLM31PG330SN1  [L_1206]
R66  value 4.7k  >NAME: R66  [R_0402]
R67  value 0  >NAME: R67  [R_0402]
R68  value 150k  >NAME: R68  [R_0402]
R69  value 226k  >NAME: R69  [R_0402]
R70  value 100  >NAME: R70  [R_0402]
U16  EN5364QI  [QFN68]

### Nets
FPGA_VCCINT_1V0: FB7.2
GND: C205.2 C206.2 C207.2 C209.2 C210.2 R69.1 R70.1 U16.1(PGND) U16.2(PGND) U16.3(PGND) U16.4(PGND) U16.27(PGND) U16.28(PGND) U16.29(PGND) U16.30(PGND) U16.31(PGND) U16.32(PGND) U16.33(PGND) U16.55(AGND) U16.64(PGND) U16.65(PGND) U16.66(PGND) U16.67(PGND) U16.68(PGND) U16.PAD69(PGND) U16.PAD70(PGND)
VCC_5V0: C205.1 C206.1 R66.2 U16.34(PVIN) U16.35(PVIN) U16.36(PVIN) U16.37(PVIN) U16.38(PVIN) U16.39(PVIN) U16.40(PVIN) U16.41(PVIN) U16.42(PVIN) U16.43(PVIN) U16.53(AVIN)
POK_VCCINT: U16.54(POK)
PWR_ENA_VCCINT: U16.52(ENABLE)
NetC207_1: C207.1 U16.59(SS)
NetC208_1: C208.1 C209.1 C210.1 FB7.1 R67.2 R68.2 R70.2 U16.5(VOUT) U16.6(VOUT) U16.7(VOUT) U16.8(VOUT) U16.9(VOUT) U16.10(VOUT) U16.11(VOUT) U16.12(VOUT) U16.13(VOUT)
NetC208_2: C208.2 R68.1 R69.2 U16.56(VFB)
NetR66_1: R66.1 U16.51(EN_PB)
NetR67_1: R67.1 U16.63(VSENSE)

Not connected (* = marked no-connect by the designer): U16 14(NC) 15(NC) 16(NC) 17(NC) 18(NC) 19(NC) 20(NC) 21(NC) 22(NC) 23(NC) 24(NC) 25(NC) 26(NC) 44(NC) 45(NC) 46(NC) 47(NC) 48(S_OUT) 49(S_IN) 50(M/S) 57(EAOUT) 58(OCP_ADJ) 60(S_DELAY) 61(MAR1) 62(MAR2)

### Notes on the sheet
- *) FPGA Power Subsystem -- CORE
- *) VCCINT = 0.6V x (1 + 150 / 226) = 0.998V
  *) OCP_ADJ is not used (default over-current threshold)
  *) MARx are not used (output at nominal 100%)
  *) S_IN/S_OUT are not used (single regulator mode)
  *) S_DELAY is not used (single regulator mode)
  *) M/S is not used (parallel operation not needed)
  *) EA_OUT is not used (default control loop)
  *) Minimal load current is 0A, but we still place
  load of 100 Ohms just in case (gives 10 mA)
- FPGA CORE voltage regulators

### Library data of the parts
C205 C206 = C-EUC1210: 1210 CAPACITOR; DIELECTRIC: X5R; RATED_VOLTAGE: 16V; TOLERANCE: 20%
C207 = C-EUC0402: 0402 CAPACITOR; DIELECTRIC: X7R; RATED_VOLTAGE: 50V; TOLERANCE: 10%; >NAME: C116
C208 = C-EUC0402: 0402 CAPACITOR; DIELECTRIC: C0G; RATED_VOLTAGE: 50V; TOLERANCE: 5%
C209 C210 = C-EUC1210: as C126 on sheet rev02_22; DIELECTRIC: X5R
FB7 = BLM31PG330SN1_1206
R66 R67 R70 = R-EU_R0402: 0402 Resistor 5%
  R66 R70: TOLERANCE: 5%
R68 R69 = R-EU_R0402: 0402 Resistor 1%; TOLERANCE: 1%
U16 = EN5364QI: 6A PowerSoC / Voltage Mode Synchronous Buck PWM DC-DC Converter / With Integrated Inductor; >NAME: U16; MPN: EN5364QI; OC_FARNELL: 2081142; PACKAGE: QFN; SUPPLIER: ENPIRION

## Sheet rev02_25.SchDoc
size 282 x 200 mm
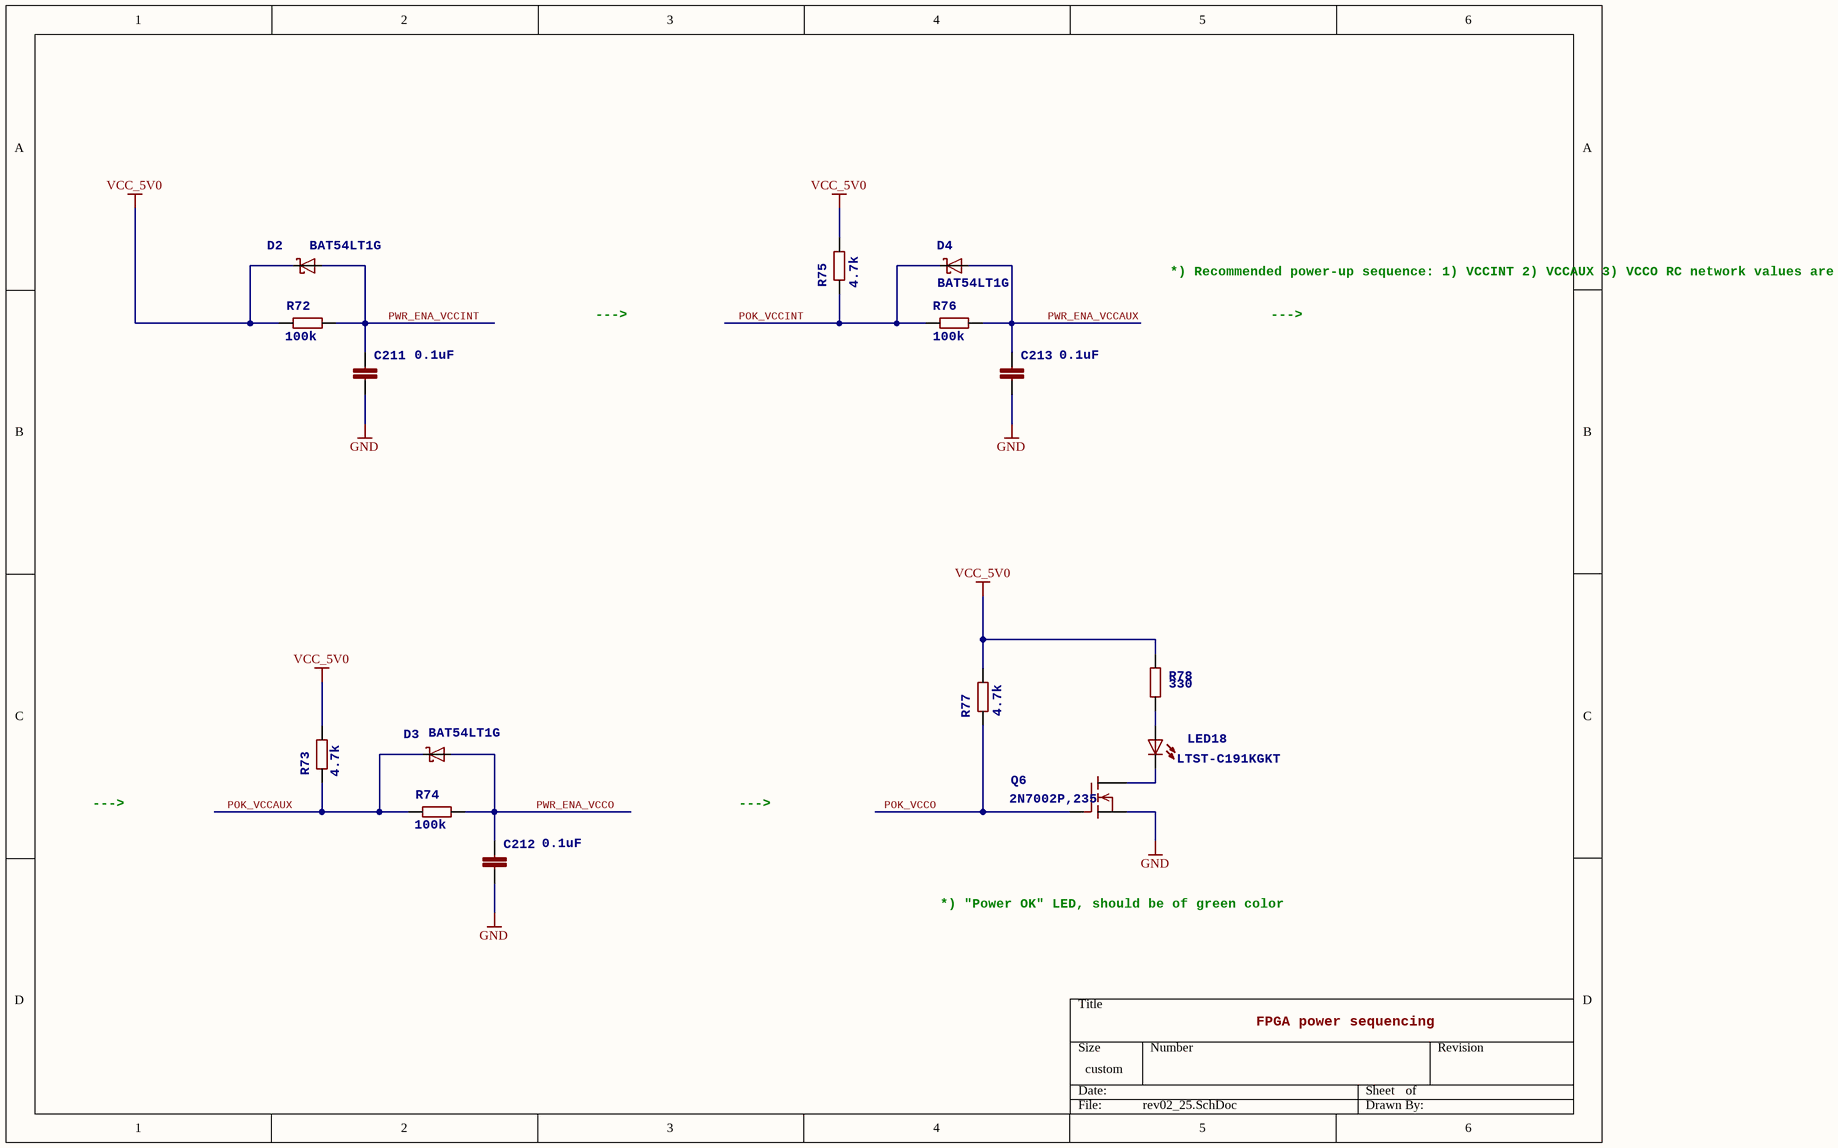
[diagram p27: rev02_25.SchDoc]

### Parts
C211  value 0.1uF  >NAME: C211  [C_0402]
C212  value 0.1uF  >NAME: C212  [C_0402]
C213  value 0.1uF  >NAME: C213  [C_0402]
D2  BAT54LT1G  >NAME: D2  [SOT-23]
D3  BAT54LT1G  >NAME: D3  [SOT-23]
D4  BAT54LT1G  >NAME: D4  [SOT-23]
LED18  LTST-C191KGKT  >NAME: LED18  [VD_0603]
Q6  2N7002P,235  >NAME: Q6  [SOT-23]
R72  value 100k  >NAME: R72  [R_0402]
R73  value 4.7k  >NAME: R73  [R_0402]
R74  value 100k  >NAME: R74  [R_0402]
R75  value 4.7k  >NAME: R75  [R_0402]
R76  value 100k  >NAME: R76  [R_0402]
R77  value 4.7k  >NAME: R77  [R_0402]
R78  value 330  >NAME: R78  [R_0402]

### Nets
GND: C211.2 C212.2 C213.2 Q6.2(S)
VCC_5V0: D2.3(C) R72.1 R73.2 R75.2 R77.2 R78.2
POK_VCCAUX: D3.3(C) R73.1 R74.1
POK_VCCINT: D4.3(C) R75.1 R76.1
POK_VCCO: Q6.1(G) R77.1
PWR_ENA_VCCAUX: C213.1 D4.1(A) R76.2
PWR_ENA_VCCINT: C211.1 D2.1(A) R72.2
PWR_ENA_VCCO: C212.1 D3.1(A) R74.2
NetLED18_1: LED18.1(A) R78.1
NetLED18_2: LED18.2(C) Q6.3(D)

### Notes on the sheet
- *) Recommended power-up sequence:
  1) VCCINT
  2) VCCAUX
  3) VCCO
  RC network values are preliminary,
  should be tweaked after experiments
- --->
- *) "Power OK" LED, should be of green color
- FPGA power sequencing

### Library data of the parts
C211-C213 = C-EUC0402: as C121 on sheet rev02_19
D2-D4 = BAT54: OnSemi Schottky Diode; >VALUE: BAT54
LED18 = LEDCHIP-LED0603: GREEN LED
Q6 = 2N7002: OnSemi FET; >VALUE: 2N7002
R72 R74 R76 = R-EU_R0402: 0402 Resistor 1%; TOLERANCE: 1%
R73 R75 R77 R78 = R-EU_R0402: 0402 Resistor 5%; TOLERANCE: 5%

## Nets that join several sheets
3V3_BATT: rev02_4 (R32.1), rev02_8 (U7.3), rev02_11 (9 pins), rev02_12 (7 pins)
15V_STABLE: rev02_1 (C11.2 C13.1 U2.6), rev02_2 (R11.1)
FPGA_VCCAUX_1V8: rev02_14 (C109.1 U13.K10), rev02_18 (FB5.2), rev02_21 (5 pins), rev02_22 (9 pins)
FPGA_VCCINT_1V0: rev02_21 (17 pins), rev02_22 (33 pins), rev02_24 (FB7.2)
GND: rev02_1 (25 pins), rev02_2 (6 pins), rev02_3 (12 pins), rev02_4 (41 pins), rev02_6 (46 pins), rev02_7 (C69.2 IC1.4), rev02_8 (C70.1 C71.1 U7.4), rev02_9 (34 pins), rev02_10 (34 pins), rev02_11 (17 pins), rev02_12 (6 pins), rev02_13 (9 pins), rev02_14 (6 pins), rev02_15 (8 pins), rev02_18 (28 pins), rev02_19 (14 pins), rev02_21 (87 pins), rev02_22 (42 pins), rev02_23 (40 pins), rev02_24 (26 pins), rev02_25 (C211.2 C212.2 C213.2 Q6.2)
VCC_5V0: rev02_1 (7 pins), rev02_18 (12 pins), rev02_24 (14 pins), rev02_25 (6 pins)
VCCO_3V3: rev02_2 (C16.2 R13.2 U3.5), rev02_3 (C19.1 J1.1 U4.41 U4.203), rev02_4 (40 pins), rev02_6 (44 pins), rev02_7 (5 pins), rev02_8 (R19.1 R20.1 R21.1 U7.8), rev02_9 (R91.1), rev02_10 (R90.1), rev02_11 (C105.1 JP4.1 JP5.1), rev02_13 (12 pins), rev02_15 (11 pins), rev02_16 (12 pins), rev02_17 (11 pins), rev02_18 (FB6.2), rev02_19 (16 pins), rev02_20 (7 pins), rev02_23 (40 pins)
ARM_FPGA_CFG_CS_N: rev02_5 (U4.104), rev02_15 (IC2.2)
ARM_FPGA_CFG_MISO: rev02_5 (U4.106), rev02_15 (IC2.12)
ARM_FPGA_CFG_MOSI: rev02_5 (U4.107), rev02_15 (IC2.6)
ARM_FPGA_CFG_SCLK: rev02_5 (U4.105), rev02_15 (IC2.4)
ARM_LED1: rev02_3 (R93.2), rev02_5 (U4.187)
ARM_LED2: rev02_3 (R92.2), rev02_5 (U4.188)
ARM_LED3: rev02_3 (R16.2), rev02_5 (U4.189)
ARM_LED4: rev02_3 (R94.2), rev02_5 (U4.190)
AVR_GPIO_ARM_0: rev02_5 (U4.97), rev02_11 (U10.17)
AVR_GPIO_ARM_1: rev02_5 (U4.96), rev02_11 (U10.19)
AVR_GPIO_ARM_2: rev02_5 (U4.91), rev02_11 (U10.20)
AVR_GPIO_ARM_3: rev02_5 (U4.90), rev02_11 (U10.22)
AVR_GPIO_FPGA_0: rev02_11 (U10.23), rev02_19 (U13.B20)
AVR_GPIO_FPGA_1: rev02_11 (U10.24), rev02_19 (U13.A20)
AVR_GPIO_FPGA_2: rev02_11 (U10.25), rev02_19 (U13.A18)
AVR_GPIO_FPGA_3: rev02_11 (U10.26), rev02_19 (U13.A19)
DIGITIZED_NOISE: rev02_2 (U3.4), rev02_20 (U13.W19)
FMC_A0: rev02_5 (U4.16), rev02_6 (U5.25 U6.25), rev02_17 (U13.Y17)
FMC_A1: rev02_5 (U4.17), rev02_6 (U5.26 U6.26), rev02_17 (U13.AB16)
FMC_A2: rev02_5 (U4.18), rev02_6 (U5.27 U6.27), rev02_17 (U13.AA16)
FMC_A3: rev02_5 (U4.22), rev02_6 (U5.60 U6.60), rev02_17 (U13.Y16)
FMC_A4: rev02_5 (U4.23), rev02_6 (U5.61 U6.61), rev02_17 (U13.AB17)
FMC_A5: rev02_5 (U4.24), rev02_6 (U5.62 U6.62), rev02_17 (U13.AA13)
FMC_A6: rev02_5 (U4.71), rev02_6 (U5.63 U6.63), rev02_17 (U13.AB13)
FMC_A7: rev02_5 (U4.74), rev02_6 (U5.64 U6.64), rev02_17 (U13.AA15)
FMC_A8: rev02_5 (U4.75), rev02_6 (U5.65 U6.65), rev02_17 (U13.AB15)
FMC_A9: rev02_5 (U4.76), rev02_6 (U5.66 U6.66), rev02_17 (U13.Y13)
FMC_A10: rev02_5 (U4.77), rev02_6 (U5.24 U6.24), rev02_17 (U13.AA14)
FMC_A11: rev02_5 (U4.78), rev02_6 (U5.21 U6.21), rev02_17 (U13.Y14)
FMC_A12: rev02_5 (U4.129), rev02_6 (U5.69 U6.69), rev02_17 (U13.AB10)
FMC_A13: rev02_5 (U4.130), rev02_17 (U13.V2)
FMC_A14: rev02_5 (U4.131), rev02_6 (U5.22 U6.22), rev02_17 (U13.AB12)
FMC_A15: rev02_5 (U4.132), rev02_6 (U5.23 U6.23), rev02_17 (U13.AB8)
FMC_A16: rev02_5 (U4.111), rev02_17 (U13.AA9)
FMC_A17: rev02_5 (U4.112), rev02_17 (U13.AA8)
FMC_A18: rev02_5 (U4.113), rev02_17 (U13.Y7)
FMC_A19: rev02_5 (U4.2), rev02_20 (U13.AB21)
FMC_A20: rev02_5 (U4.3), rev02_20 (U13.AB22)
FMC_A21: rev02_5 (U4.4), rev02_20 (U13.AB20)
FMC_A22: rev02_5 (U4.5), rev02_20 (U13.Y21)
FMC_A23: rev02_5 (U4.1), rev02_20 (U13.Y22)
FMC_A24: rev02_5 (U4.182), rev02_20 (U13.AB18)
FMC_A25: rev02_5 (U4.183), rev02_20 (U13.AA19)
FMC_CLK: rev02_5 (U4.167), rev02_17 (U13.W11)
FMC_D0: rev02_5 (U4.116), rev02_6 (U5.2 U6.2), rev02_17 (U13.AB7)
FMC_D1: rev02_5 (U4.117), rev02_6 (U5.4 U6.4), rev02_17 (U13.AB6)
FMC_D2: rev02_5 (U4.164), rev02_6 (U5.5 U6.5), rev02_17 (U13.U1)
FMC_D3: rev02_5 (U4.165), rev02_6 (U5.7 U6.7), rev02_17 (U13.U2)
FMC_D4: rev02_5 (U4.79), rev02_6 (U5.8 U6.8), rev02_17 (U13.AB11)
FMC_D5: rev02_5 (U4.80), rev02_6 (U5.10 U6.10), rev02_17 (U13.AA11)
FMC_D6: rev02_5 (U4.81), rev02_6 (U5.11 U6.11), rev02_17 (U13.Y11)
FMC_D7: rev02_5 (U4.84), rev02_6 (U5.13 U6.13), rev02_17 (U13.Y12)
FMC_D8: rev02_5 (U4.85), rev02_6 (U5.74 U6.74), rev02_20 (U13.Y18)
FMC_D9: rev02_5 (U4.86), rev02_6 (U5.76 U6.76), rev02_20 (U13.AA21)
FMC_D10: rev02_5 (U4.87), rev02_6 (U5.77 U6.77), rev02_20 (U13.W20)
FMC_D11: rev02_5 (U4.88), rev02_6 (U5.79 U6.79), rev02_20 (U13.N15)
FMC_D12: rev02_5 (U4.89), rev02_6 (U5.80 U6.80), rev02_20 (U13.U20)
FMC_D13: rev02_5 (U4.108), rev02_6 (U5.82 U6.82), rev02_17 (U13.AA1)
FMC_D14: rev02_5 (U4.109), rev02_6 (U5.83 U6.83), rev02_17 (U13.AB1)
FMC_D15: rev02_5 (U4.110), rev02_6 (U5.85 U6.85), rev02_17 (U13.AB2)
FMC_D16: rev02_5 (U4.98), rev02_6 (U5.31 U6.31), rev02_17 (U13.AB3)
FMC_D17: rev02_5 (U4.99), rev02_6 (U5.33 U6.33), rev02_17 (U13.Y3)
FMC_D18: rev02_5 (U4.100), rev02_6 (U5.34 U6.34), rev02_17 (U13.AA3)
FMC_D19: rev02_5 (U4.101), rev02_6 (U5.36 U6.36), rev02_17 (U13.AA5)
FMC_D20: rev02_5 (U4.102), rev02_6 (U5.37 U6.37), rev02_17 (U13.AB5)
FMC_D21: rev02_5 (U4.151), rev02_6 (U5.39 U6.39), rev02_17 (U13.Y4)
FMC_D22: rev02_5 (U4.152), rev02_6 (U5.40 U6.40), rev02_17 (U13.AA4)
FMC_D23: rev02_5 (U4.153), rev02_6 (U5.42 U6.42), rev02_17 (U13.V4)
FMC_D24: rev02_5 (U4.154), rev02_6 (U5.45 U6.45), rev02_17 (U13.W10)
FMC_D25: rev02_5 (U4.155), rev02_6 (U5.47 U6.47), rev02_17 (U13.R4)
FMC_D26: rev02_5 (U4.156), rev02_6 (U5.48 U6.48), rev02_17 (U13.W12)
FMC_D27: rev02_5 (U4.157), rev02_6 (U5.50 U6.50), rev02_17 (U13.W14)
FMC_D28: rev02_5 (U4.207), rev02_6 (U5.51 U6.51), rev02_20 (U13.V20)
FMC_D29: rev02_5 (U4.208), rev02_6 (U5.53 U6.53), rev02_20 (U13.V18)
FMC_D30: rev02_5 (U4.11), rev02_6 (U5.54 U6.54), rev02_20 (U13.R21)
FMC_D31: rev02_5 (U4.12), rev02_6 (U5.56 U6.56), rev02_20 (U13.P21)
FMC_NBL0: rev02_5 (U4.200), rev02_6 (U5.16 U6.16)
FMC_NBL1: rev02_5 (U4.201), rev02_6 (U5.71 U6.71)
FMC_NBL2: rev02_5 (U4.205), rev02_6 (U5.28 U6.28)
FMC_NBL3: rev02_5 (U4.206), rev02_6 (U5.59 U6.59)
FMC_NE1: rev02_5 (U4.173), rev02_17 (U13.V5)
FMC_NL: rev02_5 (U4.196), rev02_20 (U13.W17)
FMC_NOE: rev02_5 (U4.168), rev02_17 (U13.W16)
FMC_NWAIT: rev02_5 (U4.172), rev02_17 (U13.Y6)
FMC_NWE: rev02_5 (U4.169), rev02_17 (U13.AA6)
FMC_SDCKE0: rev02_5 (U4.38), rev02_6 (U5.67)
FMC_SDCKE1: rev02_5 (U4.194), rev02_6 (U6.67)
FMC_SDCLK: rev02_5 (U4.135), rev02_6 (U5.68 U6.68)
FMC_SDNCAS: rev02_5 (U4.191), rev02_6 (U5.18 U6.18)
FMC_SDNE0: rev02_5 (U4.37), rev02_6 (U5.20)
FMC_SDNE1: rev02_5 (U4.195), rev02_6 (U6.20)
FMC_SDNRAS: rev02_5 (U4.70), rev02_6 (U5.19 U6.19)
FMC_SDNWE: rev02_5 (U4.35), rev02_6 (U5.17 U6.17)
FPGA_CFG_CS_N: rev02_15 (IC2.11), rev02_20 (R85.1)
FPGA_CFG_CTRL_ARM_ENA: rev02_5 (U4.27), rev02_15 (JP7.1)
FPGA_CFG_CTRL_FPGA_DIS: rev02_5 (U4.21), rev02_15 (JP7.3)
FPGA_CFG_MISO: rev02_15 (IC2.3), rev02_20 (R84.1)
FPGA_CFG_MOSI: rev02_15 (IC2.15), rev02_20 (R83.1)
FPGA_CFG_SCLK: rev02_13 (R71.1), rev02_15 (IC2.13)
FPGA_DONE: rev02_5 (U4.177), rev02_13 (R39.1)
FPGA_ENTROPY_DISABLE: rev02_1 (R5.1), rev02_19 (U13.B18)
FPGA_GCLK: rev02_15 (R4.1), rev02_19 (U13.D17)
FPGA_GPIO_LED_0: rev02_17 (U13.U3), rev02_19 (R100.2)
FPGA_GPIO_LED_1: rev02_17 (U13.T1), rev02_19 (R64.2)
FPGA_GPIO_LED_2: rev02_19 (R98.2), rev02_20 (U13.W22)
FPGA_GPIO_LED_3: rev02_19 (R99.2), rev02_20 (U13.AA20)
FPGA_INIT_B: rev02_5 (U4.119), rev02_13 (Q4.1 R42.2)
FPGA_IRQ_N_0: rev02_5 (U4.122), rev02_19 (U13.F14)
FPGA_IRQ_N_1: rev02_5 (U4.123), rev02_19 (U13.F16)
FPGA_IRQ_N_2: rev02_5 (U4.174), rev02_19 (U13.E17)
FPGA_IRQ_N_3: rev02_5 (U4.175), rev02_19 (U13.C14)
FPGA_PROGRAM_B: rev02_5 (U4.120), rev02_13 (R41.1 R63.1)
FT_CTS: rev02_5 (U4.44), rev02_9 (U8.16)
FT_DTR: rev02_5 (U4.53), rev02_9 (U8.17)
FT_MGMT_CTS: rev02_5 (U4.146), rev02_10 (U9.16)
FT_MGMT_DTR: rev02_5 (U4.142), rev02_10 (U9.17)
FT_MGMT_RTS: rev02_5 (U4.145), rev02_10 (U9.15)
FT_MGMT_RXD: rev02_5 (U4.143), rev02_10 (R89.1)
FT_MGMT_TXD: rev02_5 (U4.144), rev02_10 (R88.1 R90.2)
FT_RTS: rev02_5 (U4.43), rev02_9 (U8.15)
FT_RXD: rev02_5 (U4.45), rev02_9 (R87.1)
FT_TXD: rev02_5 (U4.50), rev02_9 (R86.1 R91.2)
KSM_PROM_CS_N: rev02_5 (U4.61), rev02_7 (IC1.1 R18.2)
KSM_PROM_MISO: rev02_5 (U4.55), rev02_7 (IC1.2)
KSM_PROM_MOSI: rev02_5 (U4.56), rev02_7 (IC1.5)
KSM_PROM_SCLK: rev02_5 (U4.54), rev02_7 (IC1.6)
MKM_AVR_CS_N: rev02_11 (U10.14), rev02_12 (IC4.2)
MKM_AVR_MISO: rev02_11 (JP3.1 U10.28), rev02_12 (IC4.12 JP6.2)
MKM_AVR_MOSI: rev02_11 (JP3.4 U10.27), rev02_12 (IC4.6)
MKM_AVR_SCK: rev02_11 (JP3.3 U10.30), rev02_12 (IC4.4)
MKM_CONTROL_AVR_ENA: rev02_11 (U10.15), rev02_12 (IC4.1 R80.1)
MKM_CONTROL_FPGA_DIS: rev02_11 (U10.16), rev02_12 (IC4.19 R81.1)
MKM_FPGA_CS_N: rev02_12 (IC4.11), rev02_17 (U13.W2)
MKM_FPGA_MISO: rev02_12 (IC4.3), rev02_17 (U13.Y1)
MKM_FPGA_MOSI: rev02_12 (IC4.15), rev02_17 (U13.W1)
MKM_FPGA_SCK: rev02_12 (IC4.13), rev02_17 (U13.V3)
POK_VCCAUX: rev02_18 (U14.28), rev02_25 (D3.3 R73.1 R74.1)
POK_VCCINT: rev02_24 (U16.54), rev02_25 (D4.3 R75.1 R76.1)
POK_VCCO: rev02_18 (U15.28), rev02_25 (Q6.1 R77.1)
PWR_ENA_VCCAUX: rev02_18 (U14.27), rev02_25 (C213.1 D4.1 R76.2)
PWR_ENA_VCCINT: rev02_24 (U16.52), rev02_25 (C211.1 D2.1 R72.2)
PWR_ENA_VCCO: rev02_18 (U15.27), rev02_25 (C212.1 D3.1 R74.2)
RTC_MFP: rev02_5 (U4.47), rev02_8 (R21.2 U7.7)
RTC_SCL: rev02_5 (U4.48), rev02_8 (R20.2 U7.6)
RTC_SDA: rev02_5 (U4.49), rev02_8 (R19.2 U7.5)